# Altium project PCB_Project1.PrjPCB (part 1 of 2)
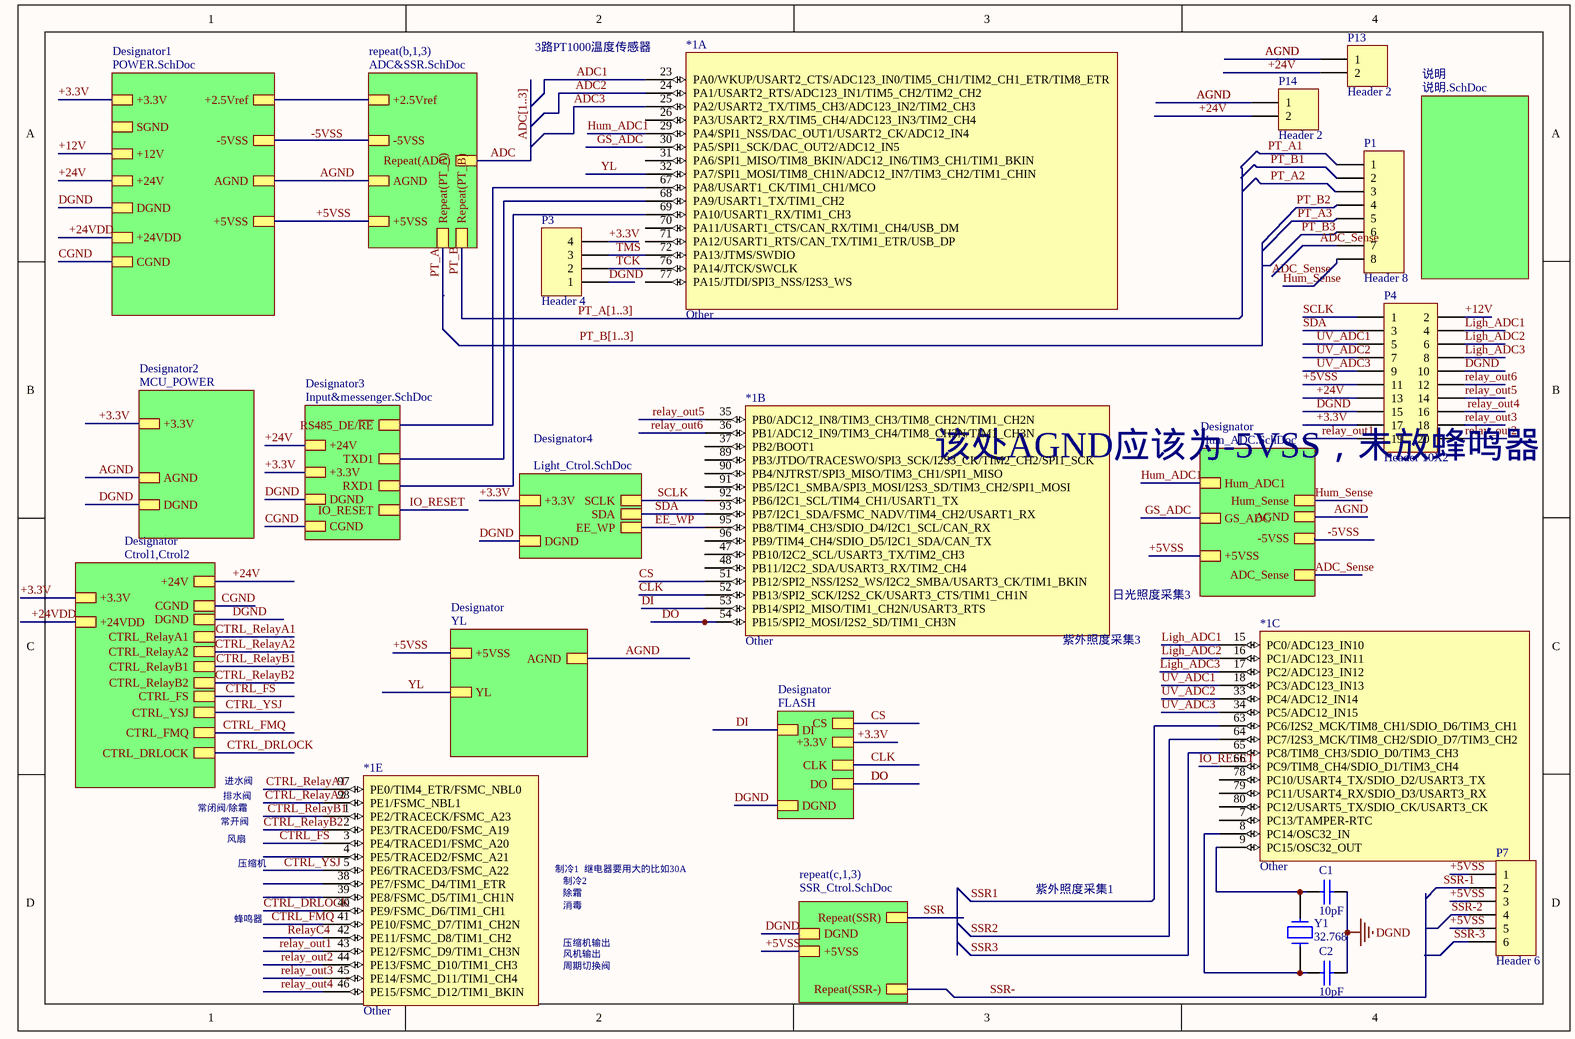
[diagram p0: main.SchDoc]
16 sheets, 275 parts. Net scope: hierarchical (ports join the sheet entries above them; power ports are global).
Board file: 新主控制.PcbDoc
Sheets:
  main.SchDoc
    Designator1 = POWER.SchDoc
    b1 = ADC&SSR.SchDoc
    b2 = ADC&SSR.SchDoc
    b3 = ADC&SSR.SchDoc
    Designator3 = Input&messenger.SchDoc
      d1 = In_put .SchDoc
      d2 = In_put .SchDoc
      d3 = In_put .SchDoc
      d4 = In_put .SchDoc
      d5 = In_put .SchDoc
      Designator5 = messenger.SchDoc
    Designator4 = Light_Ctrol.SchDoc
    Designator2 = MCU_POWER.SchDoc
    c1 = SSR_Ctrol.SchDoc
    c2 = SSR_Ctrol.SchDoc
    c3 = SSR_Ctrol.SchDoc
    说明 = 说明.SchDoc
    Designator = Hum_ADC.SchDoc
    Designator = FLASH.SchDoc
    Designator = Ctrol1,Ctrol2.SchDoc
      a1 = Ctrol1.SchDoc
      a2 = Ctrol1.SchDoc
      Designator = Ctrol2.SchDoc
    Designator = YL.SchDoc

## Sheet main.SchDoc
size A4

### Parts
*1  Other  [STM-LQFP100_N]  (parts A,B,C,E of 6)
C1  10pF  [0805C]
C2  10pF  [0805C]
P1  Header 8  [CONN-TH-KF7.62-8p]
P3  Header 4  [HDR1X4]
P4  Header 10X2  [HDR-TH_20P-P2.54_DC3-2.54-20PAS]
P7  Header 6  [CONN-TH_6P-P7.62_WJ25C-B-7.62-6P]
P13  Header 2  [2P]
P14  Header 2  [2PPPPP]
Y1  32.768  [XTAL6]

### Sub-sheets
Designator = Hum_ADC.SchDoc: Hum_ADC1, +5VSS, -5VSS, Hum_Sense, ADC_Sense, AGND, GS_ADC
Designator = FLASH: DGND, +3.3V, CLK, CS, DO, DI
Designator = Ctrol1,Ctrol2: +3.3V, +24V, DGND, CGND, CTRL_RelayA1, CTRL_RelayA2, CTRL_RelayB1, CTRL_RelayB2, CTRL_FS, CTRL_YSJ, CTRL_FMQ, CTRL_DRLOCK, +24VDD
Designator = YL: +5VSS, AGND, YL
Designator1 = POWER.SchDoc: +3.3V, +5VSS, +12V, +24V, AGND, DGND, -5VSS, SGND, +2.5Vref, CGND, +24VDD
Designator2 = MCU_POWER: +3.3V, AGND, DGND
Designator3 = Input&messenger.SchDoc: +24V, +3.3V, DGND, CGND, RS485_DE/~{RE}, TXD1, RXD1, IO_RESET
Designator4 = Light_Ctrol.SchDoc: SCLK, SDA, +3.3V, DGND, EE_WP
repeat(b,1,3) = ADC&SSR.SchDoc: -5VSS, AGND, +5VSS, +2.5Vref, Repeat(ADC), Repeat(PT_A), Repeat(PT_B)
repeat(c,1,3) = SSR_Ctrol.SchDoc: Repeat(SSR), DGND, +5VSS, Repeat(SSR-)
说明 = 说明.SchDoc: no entries

### Nets
+2.5Vref: sheet Designator1/+2.5Vref, sheet repeat(b,1,3)/+2.5Vref
+3.3V: P3.4 P4.17 ; sheet Designator1/+3.3V, sheet Designator3/+3.3V, sheet Designator4/+3.3V, sheet Designator2/+3.3V, sheet Designator/+3.3V, sheet Designator/+3.3V
+5VSS: P4.11 P7.1 P7.3 P7.5 ; sheet Designator1/+5VSS, sheet repeat(b,1,3)/+5VSS, sheet repeat(c,1,3)/+5VSS, sheet Designator/+5VSS, sheet Designator/+5VSS
+12V: P4.2 ; sheet Designator1/+12V
+24V: P4.13 P13.2 P14.2 ; sheet Designator1/+24V, sheet Designator3/+24V, sheet Designator/+24V
+24VDD: sheet Designator1/+24VDD, sheet Designator/+24VDD
-5VSS: sheet Designator1/-5VSS, sheet repeat(b,1,3)/-5VSS, sheet Designator/-5VSS
AGND: P13.1 P14.1 ; sheet Designator1/AGND, sheet repeat(b,1,3)/AGND, sheet Designator2/AGND, sheet Designator/AGND, sheet Designator/AGND
CGND: sheet Designator1/CGND, sheet Designator3/CGND, sheet Designator/CGND
DGND: C1.1 C2.1 P3.1 P4.10 P4.15 ; sheet Designator1/DGND, sheet Designator3/DGND, sheet Designator4/DGND, sheet Designator2/DGND, sheet repeat(c,1,3)/DGND, sheet Designator/DGND, sheet Designator/DGND
ADC: sheet repeat(b,1,3)/Repeat(ADC)
ADC1: *1.23(PA0/WKUP/USART2_CTS/ADC123_IN0/TIM5_CH1/TIM2_CH1_ETR/TIM8_ETR)  [project net ADC]
ADC2: *1.24(PA1/USART2_RTS/ADC123_IN1/TIM5_CH2/TIM2_CH2)  [project net ADC]
ADC3: *1.25(PA2/USART2_TX/TIM5_CH3/ADC123_IN2/TIM2_CH3)  [project net ADC]
ADC_Sense: P1.7 ; sheet Designator/ADC_Sense
CLK: *1.52(PB13/SPI2_SCK/I2S2_CK/USART3_CTS/TIM1_CH1N) ; sheet Designator/CLK
CS: *1.51(PB12/SPI2_NSS/I2S2_WS/I2C2_SMBA/USART3_CK/TIM1_BKIN) ; sheet Designator/CS
CTRL_DRLOCK: *1.40(PE9/FSMC_D6/TIM1_CH1) ; sheet Designator/CTRL_DRLOCK
CTRL_FMQ: *1.41(PE10/FSMC_D7/TIM1_CH2N) ; sheet Designator/CTRL_FMQ
CTRL_FS: *1.3(PE4/TRACED1/FSMC_A20) ; sheet Designator/CTRL_FS
CTRL_RelayA1: *1.97(PE0/TIM4_ETR/FSMC_NBL0) ; sheet Designator/CTRL_RelayA1
CTRL_RelayA2: *1.98(PE1/FSMC_NBL1) ; sheet Designator/CTRL_RelayA2
CTRL_RelayB1: *1.1(PE2/TRACECK/FSMC_A23) ; sheet Designator/CTRL_RelayB1
CTRL_RelayB2: *1.2(PE3/TRACED0/FSMC_A19) ; sheet Designator/CTRL_RelayB2
CTRL_YSJ: *1.5(PE6/TRACED3/FSMC_A22) ; sheet Designator/CTRL_YSJ
DI: *1.53(PB14/SPI2_MISO/TIM1_CH2N/USART3_RTS) ; sheet Designator/DI
DO: *1.54(PB15/SPI2_MOSI/I2S2_SD/TIM1_CH3N) ; sheet Designator/DO
EE_WP: *1.95(PB8/TIM4_CH3/SDIO_D4/I2C1_SCL/CAN_RX) ; sheet Designator4/EE_WP
GS_ADC: *1.30(PA5/SPI1_SCK/DAC_OUT2/ADC12_IN5) ; sheet Designator/GS_ADC
Hum_ADC1: *1.29(PA4/SPI1_NSS/DAC_OUT1/USART2_CK/ADC12_IN4) ; sheet Designator/Hum_ADC1
Hum_Sense: P1.8 ; sheet Designator/Hum_Sense
IO_RESET: *1.66(PC9/TIM8_CH4/SDIO_D1/TIM3_CH4) ; sheet Designator3/IO_RESET
Ligh_ADC1: *1.15(PC0/ADC123_IN10) P4.4
Ligh_ADC2: *1.16(PC1/ADC123_IN11) P4.6
Ligh_ADC3: *1.17(PC2/ADC123_IN12) P4.8
PT_A: sheet repeat(b,1,3)/Repeat(PT_A)
PT_A1: P1.1
PT_A2: P1.3
PT_A3: P1.5
PT_B: sheet repeat(b,1,3)/Repeat(PT_B)
PT_B1: P1.2
PT_B2: P1.4
PT_B3: P1.6
relay_out1: *1.43(PE12/FSMC_D9/TIM1_CH3N) P4.19
relay_out2: *1.44(PE13/FSMC_D10/TIM1_CH3) P4.20
relay_out3: *1.45(PE14/FSMC_D11/TIM1_CH4) P4.18
relay_out4: *1.46(PE15/FSMC_D12/TIM1_BKIN) P4.16
relay_out5: *1.35(PB0/ADC12_IN8/TIM3_CH3/TIM8_CH2N/TIM1_CH2N) P4.14
relay_out6: *1.36(PB1/ADC12_IN9/TIM3_CH4/TIM8_CH3N/TIM1_CH3N) P4.12
RelayC4: *1.42(PE11/FSMC_D8/TIM1_CH2)
RS485_DE/~{RE}: *1.67(PA8/USART1_CK/TIM1_CH1/MCO) ; sheet Designator3/RS485_DE/~{RE}
RXD1: *1.69(PA10/USART1_RX/TIM1_CH3) ; sheet Designator3/RXD1
SCLK: *1.92(PB6/I2C1_SCL/TIM4_CH1/USART1_TX) P4.1 ; sheet Designator4/SCLK
SDA: *1.93(PB7/I2C1_SDA/FSMC_NADV/TIM4_CH2/USART1_RX) P4.3 ; sheet Designator4/SDA
SSR: sheet repeat(c,1,3)/Repeat(SSR)
SSR1: *1.63(PC6/I2S2_MCK/TIM8_CH1/SDIO_D6/TIM3_CH1)
SSR2: *1.64(PC7/I2S3_MCK/TIM8_CH2/SDIO_D7/TIM3_CH2)
SSR3: *1.65(PC8/TIM8_CH3/SDIO_D0/TIM3_CH3)
SSR-: sheet repeat(c,1,3)/Repeat(SSR-)
SSR-1: P7.2
SSR-2: P7.4
SSR-3: P7.6
TCK: *1.76(PA14/JTCK/SWCLK) P3.2
TMS: *1.72(PA13/JTMS/SWDIO) P3.3
TXD1: *1.68(PA9/USART1_TX/TIM1_CH2) ; sheet Designator3/TXD1
UV_ADC1: *1.18(PC3/ADC123_IN13) P4.5
UV_ADC2: *1.33(PC4/ADC12_IN14) P4.7
UV_ADC3: *1.34(PC5/ADC12_IN15) P4.9
YL: *1.32(PA7/SPI1_MOSI/TIM8_CH1N/ADC12_IN7/TIM3_CH2/TIM1_CHIN) ; sheet Designator/YL
Net*1_8: *1.8(PC14/OSC32_IN) C2.2 Y1.1
Net*1_9: *1.9(PC15/OSC32_OUT) C1.2 Y1.2

Not connected (* = marked no-connect by the designer): *1 4(PE5/TRACED2/FSMC_A21) 7(PC13/TAMPER-RTC) 26(PA3/USART2_RX/TIM5_CH4/ADC123_IN3/TIM2_CH4) 31(PA6/SPI1_MISO/TIM8_BKIN/ADC12_IN6/TIM3_CH1/TIM1_BKIN) 37(PB2/BOOT1) 38(PE7/FSMC_D4/TIM1_ETR) 39(PE8/FSMC_D5/TIM1_CH1N) 47(PB10/I2C2_SCL/USART3_TX/TIM2_CH3) 48(PB11/I2C2_SDA/USART3_RX/TIM2_CH4) 70(PA11/USART1_CTS/CAN_RX/TIM1_CH4/USB_DM) 71(PA12/USART1_RTS/CAN_TX/TIM1_ETR/USB_DP) 77(PA15/JTDI/SPI3_NSS/I2S3_WS) 78(PC10/USART4_TX/SDIO_D2/USART3_TX) 79(PC11/USART4_RX/SDIO_D3/USART3_RX) 80(PC12/USART5_TX/SDIO_CK/USART3_CK) 89(PB3/JTDO/TRACESWO/SPI3_SCK/I2S3_CK/TIM2_CH2/SPI1_SCK) 90(PB4/NJTRST/SPI3_MISO/TIM3_CH1/SPI1_MISO) 91(PB5/I2C1_SMBA/SPI3_MOSI/I2S3_SD/TIM3_CH2/SPI1_MOSI) 96(PB9/TIM4_CH4/SDIO_D5/I2C1_SDA/CAN_TX)

### Buses and harness runs
bus ADC[1..3]
bus PT_A[1..3]
bus PT_B[1..3]

### Notes on the sheet
- 3路PT1000温度传感器
- 该处AGND应该为-5VSS，未放蜂鸣器
- 紫外照度采集3
- 日光照度采集3
- 进水阀
- 常闭阀/除霜
- 常开阀
- 排水阀
- 风扇
- 蜂鸣器
- 压缩机
- 制冷1  继电器要用大的比如30A
- 除霜
- 制冷2
- 消毒
- 紫外照度采集1
- 风机输出
- 压缩机输出
- 周期切换阀
- Labels drawn without touching a wire or pin: -5VSS, PT_B[1..3]

### Library data of the parts
*1 = stm32f103vct6
C1 C2 = CAP_3: 品牌： SAMSUNG(三星)  型号： CL21C100JCANNNC 容值：10pF 精度：±5% 额定电压：100V 材质(温度系数)：C0G C0G
P1 = Header 8: DG141V-2.54-8; LatestRevisionDate: 17-Jul-2002; LatestRevisionNote: Re-released for DXP Platform.; Publisher: Altium Limited
P3 = Header 4: 品牌： XFCN(兴飞) 型号： PZ254V-11-04P  排数：单排 总PIN位数：4P 间距：2.54mm 插针结构：1x4P 安装类型：直插 圆针/方针：方针 额定电流：3A 额定电压：250V 配合针长度：6mm 塑高：2.5mm 端接针长度：3mm 工作温度范围：-40℃~+105℃ 颜色：黑色; LatestRevisionDate: 17-Jul-2002; LatestRevisionNote: Re-released for DXP Platform.; Publisher: Altium Limited
P4 = Header 10X2: 品牌： ZHOURI(洲日)   型号： DC3-2.54-20PAS  ：连接器类型：简牛座 间距：2.54mm 结构：2x10P 排数：2 每排PIN数：10 行距：2.54mm 封装形式：直插 额定电流：1.5A 工作温度范围：-40℃~+105℃ 简易牛角 2.54-2x10 ROHS 直插; LatestRevisionDate: 17-Jul-2002; LatestRevisionNote: Re-released for DXP Platform.; Publisher: Altium Limited
P7 = Header 6: 品牌： KEFA(科发)  KF7.62-6p隔板类型：两面 间距：7.62mm 结构：1x2P 每排PIN数：2 排数：1 安装方式：直针 引脚位置：边脚 额定电流：24A 额定电压：450V 线规 - AWG：12~22 线规 - mm2：2.5 工作温度范围：-40℃~+105℃ 颜色：黑色 黑色; LatestRevisionDate: 17-Jul-2002; LatestRevisionNote: Re-released for DXP Platform.; Publisher: Altium Limited
P13 P14 = Header 2: DG141V-2.54-2P; LatestRevisionDate: 17-Jul-2002; LatestRevisionNote: Re-released for DXP Platform.; Publisher: Altium Limited
  P14: ComponentLink1Description: New link; ComponentLink1URL: *
Y1 = XTAL-2: 品牌： YXC(扬兴晶振)  型号： X308032768KGB2SC 频率：32.768kHz 频率公差：±10ppm 负载电容：12.5pF YT-38 温飘系数: -0.04x 10^(-6)/℃2

## Sheet POWER.SchDoc
size A4
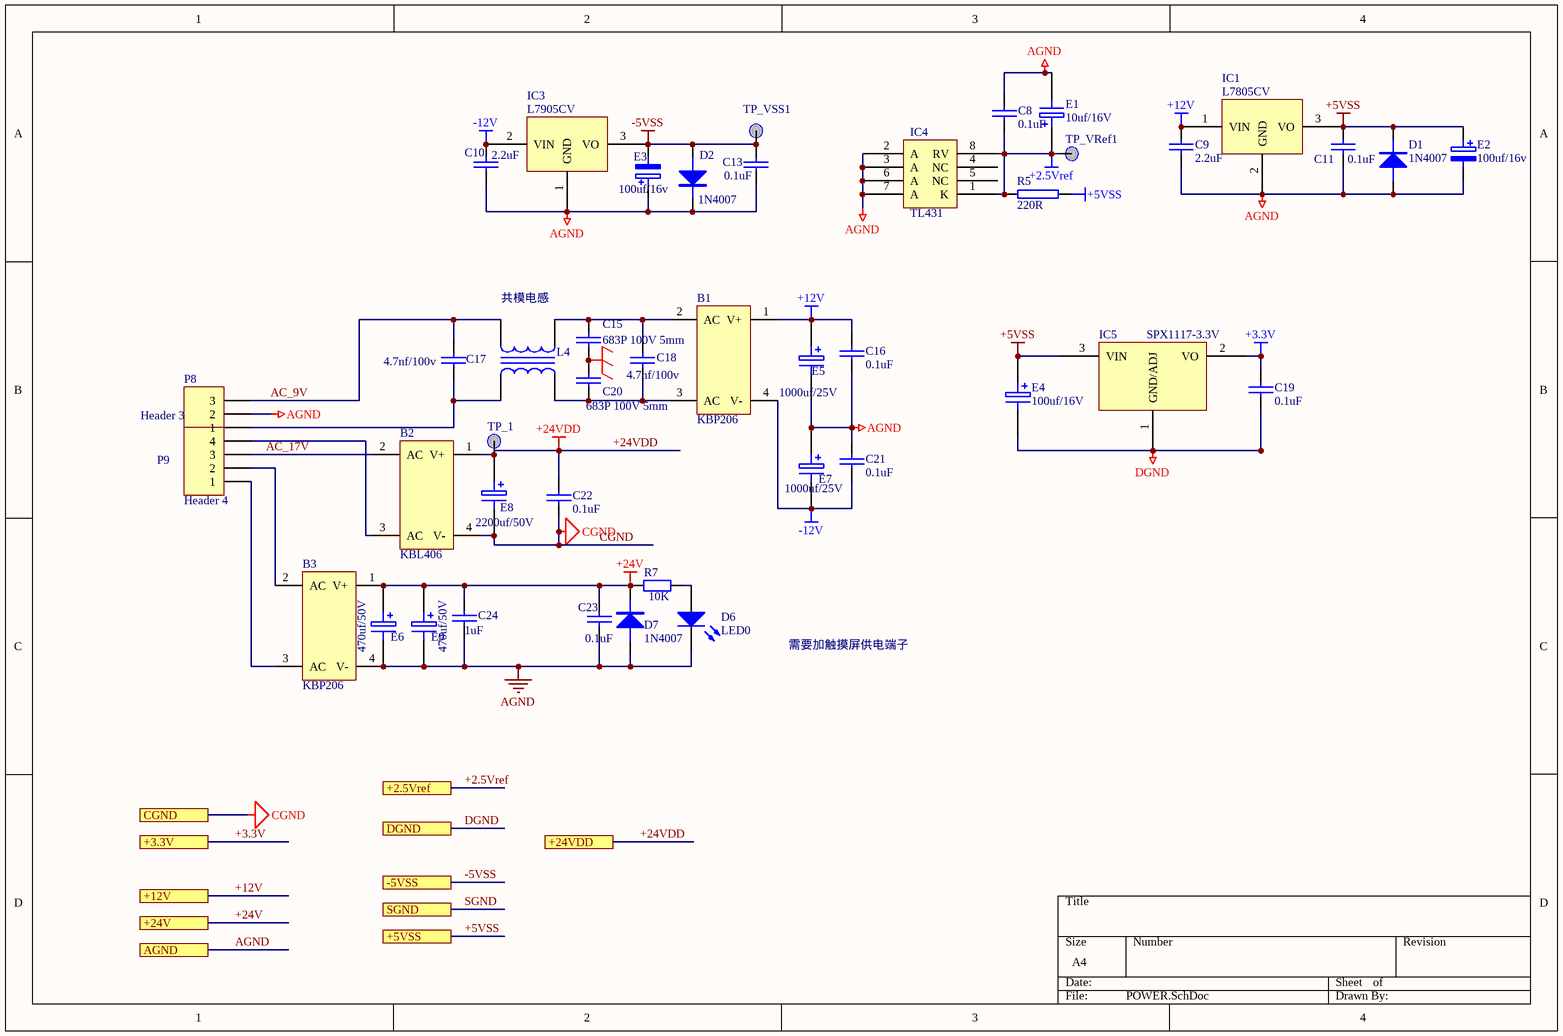
[diagram p1: POWER.SchDoc]

### Parts
B1  KBP206  [KBP206]
B2  KBL406  [KPL406]
B3  KBP206  [KBP206]
C8  0.1uF  [0805C]
C9  2.2uF  [0805C]
C10  2.2uF  [0805C]
C11  0.1uF  [0805C]
C13  0.1uF  [0805C]
C15  683P 100V 5mm  [CP1]
C16  0.1uF  [0805C]
C17  4.7nf/100v  [CP1]
C18  4.7nf/100v  [CP1]
C19  0.1uF  [0805C]
C20  683P 100V 5mm  [CP1]
C21  0.1uF  [0805C]
C22  0.1uF  [0805C]
C23  0.1uF  [0805C]
C24  1uF  [0805C]
D1  1N4007  [SK24]
D2  1N4007  [SK24]
D6  LED0  [0805LED]
D7  1N4007  [SK24]
E1  10uf/16V  [3528]
E2  100uf/16v  [3528]
E3  100uf/16v  [3528]
E4  100uf/16V  [3528]
E5  1000uf/25V  [EC5.08-10.5]
E6  470uf/50V  [EC5.08-10.5]
E7  1000uf/25V  [EC5.08-10.5]
E8  2200uf/50V  [EC5.08-13.5]
E9  470uf/50V  [EC5.08-10.5]
IC1  L7805CV  [DPAK3]
IC3  L7905CV  [DPAK3]
IC4  TL431  [SO8]
IC5  SPX1117-3.3V  [SOT223]
L4  共模电感  [TRANS]
P8  Header 3  [CONN-TH-KF7.62-3P]
P9  Header 4  [CONN-TH_KF7.62-4P]
R5  220R  [0805R]
R7  10K  [0805R]
TP_1  (no value)  [TPP]
TP_VRef1  (no value)  [TPP]
TP_VSS1  (no value)  [TPP]

### Ports
+2.5Vref, +3.3V, +5VSS, +12V, +24V, +24VDD, -5VSS, AGND, CGND, DGND, SGND

### Nets
+2.5Vref: C8.2 E1.1 IC4.1(K) IC4.8(RV) R5.1 TP_VRef1.1 ; port +2.5Vref
+3.3V: C19.1 IC5.2(VO) ; port +3.3V
+5VSS: C11.1 D1.2(K) E2.1 E4.1 IC1.3(VO) IC5.3(VIN) R5.2 ; port +5VSS
+12V: B1.1(V+) C9.1 C16.1 E5.1 IC1.1(VIN) ; port +12V
+24V: B3.1(V+) C23.1 C24.1 D7.2(K) E6.1 E9.1 R7.2 ; port +24V
+24VDD: B2.1(V+) C22.1 E8.1 TP_1.1 ; port +24VDD
-5VSS: C13.1 D2.1(A) E3.2 IC3.3(VO) TP_VSS1.1 ; port -5VSS
-12V: B1.4(V-) C10.1 C21.2 E7.2 IC3.2(VIN)
AGND: B3.4(V-) C8.1 C9.2 C10.2 C11.2 C13.2 C16.2 C21.1 C23.2 C24.2 D1.1(A) D2.2(K) D6.2(K) D7.1(A) E1.2 E2.2 E3.1 E5.2 E6.2 E7.1 E9.2 IC1.2(GND) IC3.1(GND) IC4.2(A) IC4.3(A) IC4.6(A) IC4.7(A) P8.2 ; port AGND
CGND: B2.4(V-) C22.2 E8.2 ; port CGND
DGND: C19.2 E4.2 IC5.1(GND/ADJ) ; port DGND
EGND: C15.2 C20.1
AC_9V: C17.1 L4.2 P8.3
AC_17V: B2.2(AC) P9.3
SGND: port SGND
NetB1_2: B1.2(AC) C15.1 C18.1 L4.4
NetB1_3: B1.3(AC) C18.2 C20.2 L4.3
NetB2_3: B2.3(AC) P9.4
NetB3_2: B3.2(AC) P9.2
NetB3_3: B3.3(AC) P9.1
NetC17_2: C17.2 L4.1 P8.1
NetD6_1: D6.1(A) R7.1

Not connected (* = marked no-connect by the designer): IC4 4(NC) 5(NC)

### Notes on the sheet
- 需要加触摸屏供电端子

### Library data of the parts
B1 B3 = BRIDGE: 品牌： MDD  型号： KBP206  直流反向耐压(Vr)：600V 平均整流电流(Io)：2A 正向压降(Vf)：1.1V@2A 正向浪涌电流(Ifsm)：60A
B2 = BRIDGE: 品牌： MDD  型号： KBL406  直流反向耐压(Vr)：600V 平均整流电流(Io)：4A 正向压降(Vf)：1V@4A 正向浪涌电流(Ifsm)：125A
C8 = CAP
C9 C10 = Cap: 品牌： SAMSUNG(三星) 型号： CL21B225KAFNNNE 容值：2.2uF 精度：±10% 额定电压：25V 材质(温度系数)：X7R 材质:X7R; Value: 104P
C11 C22 = Cap: 品牌： SAMSUNG(三星) 型号： CL21B104KBCNNNC ：容值：100nF 精度：±10% 额定电压：50V 材质(温度系数)：X7R 材质:X7R; Value: 104P
C13 C16 = Cap: 品牌： SAMSUNG(三星)    型号： CL10B104KB8NNNC  容值：100nF 精度：±10% 额定电压：50V 材质(温度系数)：X7R 材质:X7R; Value: 104P
C15 C20 = Cap: 品牌： muRata(村田) 型号： RCER72A683K1K1H03B  容值：68nF 精度：±10% 额定电压：100V 温度系数：X7R; Value: 683P 100V 5mm
C17 = Cap: 品牌： muRata(村田) 品牌： muRata(村田)  容值：4.7nF 精度：±10% 额定电压：100V 温度系数：X7R; Value: 472P 100V 5mm
C18 = Cap: 品牌： muRata(村田) 品牌： muRata(村田)  容值：4.7nF 精度：±10% 额定电压：100V 温度系数：X7R; Value: 472P
C19 = CAP: Capacitor
C21 = Cap: 品牌： SAMSUNG(三星)    型号： CL10B104KB8NNNC  容值：100nF 精度：±10% 额定电压：50V 材质(温度系数)：X7R 材质:X7R
C23 = Cap: 品牌： SAMSUNG(三星) 型号： CL21B104KBCNNNC ：容值：100nF 精度：±10% 额定电压：50V 材质(温度系数)：X7R 材质:X7R; Value: 0.1uF
C24 = Cap: 品牌： SAMSUNG(三星) 型号： CL21B334KBFNNNE 容值：330nF 精度：±10% 额定电压：50V 材质(温度系数)：X7R 材质:X7R; Value: 0.33uF
D1 D2 D7 = DIODE: 品牌： TWGMC(台湾迪嘉) 型号： 1N4001 极管配置：独立式 直流反向耐压(Vr)：50V 平均整流电流(Io)：1A 正向压降(Vf)：1.1V@1A 二极管配置：独立式 直流反向耐压(Vr)：50V 平均整流电流(Io)：1A 正向压降(Vf)：1.1V@1A
D6 = LED0: 品牌： 国星光电 型号： NCD0805B2 发光颜色：蓝灯 贴片LED；0805蓝色；2012蓝色；透镜颜色：无色透明；发光角度：130°；功率：72mW；工作温度：-30℃~+85℃；; Published: 8-Jun-2000; LatestRevisionDate: 08-Jul-2005; LatestRevisionNote: Mech Layer 1 removed.; PackageReference: LED-0; Publisher: Altium Limited; PackageDescription: LED; 2 Leads
E1 = ELECTRO1: 品牌： Kyocera AVX 型号： TAJB106K016RNJ ：容值：10uF 精度：±10% 额定电压：16V 等效串联电阻：2.8Ω@100kHz
E2 E3 = ELECTRO2: 品牌： Kyocera AVX 型号： TAJB107M010RNJ  容值：100uF 精度：±20% 额定电压：10V 等效串联电阻：1.4Ω@100kHz; Value: 100uf/16V
E4 = ELECTRO1: Electrolytic Capacitor
E5 E7 = ELECTRO1: 品牌： CX(承兴) 型号： KM108M025G17RR0VH2FP0 容值：1000uF 精度：±20% 额定电压：25V; Value: 1000uf/25V
E6 E9 = ELECTRO1: 品牌： CX(承兴) 型号： KM108M025G17RR0VH2FP0 容值：1000uF 精度：±20% 额定电压：25V; Value: 1000uf/25V
E8 = ELECTRO1: 品牌： CX(承兴) 型号： KM228M050K30RR0VH2FP0 容值：2200uF 精度：±20% 额定电压：50V; Value: 2200uf/50V
IC1 = MC78XX: 品牌： UMW(友台半导体)  型号： L7805CV  输出类型：固定 输出极性：正 最大输入电压：35V 输出电压：5V 输出电流：1.2A
IC3 = MC79XX: 品牌： ST(意法半导体) 封装： TO-220 输出类型：固定 输出极性：负 最大输入电压：35V 输出电压：5V 输出电流：1.5A 电源纹波抑制比(PSRR)：60dB@(120Hz) 薄片 5.0V
IC4 = TL431-SO8: 品牌： JSMSEMI(杰盛微) 型号： TL431输出类型：可调 输入电压：37V 输出电压：2.5V~36V
IC5 = SPX1117
L4 = TRANS1: UF16 22mH 1.5A 12.5*10
P8 = Header 3: 品牌： KEFA(科发)  KF7.62-3p隔板类型：两面 间距：7.62mm 结构：1x2P 每排PIN数：2 排数：1 安装方式：直针 引脚位置：边脚 额定电流：24A 额定电压：450V 线规 - AWG：12~22 线规 - mm2：2.5 工作温度范围：-40℃~+105℃ 颜色：黑色 黑色; LatestRevisionDate: 17-Jul-2002; LatestRevisionNote: Re-released for DXP Platform.; Publisher: Altium Limited
P9 = Header 4: 品牌： KEFA(科发)  KF7.62-4p隔板类型：两面 间距：7.62mm 结构：1x2P 每排PIN数：2 排数：1 安装方式：直针 引脚位置：边脚 额定电流：24A 额定电压：450V 线规 - AWG：12~22 线规 - mm2：2.5 工作温度范围：-40℃~+105℃ 颜色：黑色 黑色; LatestRevisionDate: 17-Jul-2002; LatestRevisionNote: Re-released for DXP Platform.; Publisher: Altium Limited
R5 = RES2: 品牌： UNI-ROYAL(厚声) 型号： 0805W8J0221T5E 电阻类型：厚膜电阻 阻值：220Ω 精度：±5% 功率：125mW 温度系数：±100ppm/℃
R7 = Res2: 品牌： UNI-ROYAL(厚声) 型号： 0805W8F1002T5E 电阻类型：厚膜电阻 阻值：10kΩ 精度：±1% 功率：125mW 温度系数：±100ppm/℃; Published: 8-Jun-2000; LatestRevisionDate: 17-Jul-2002; LatestRevisionNote: Re-released for DXP Platform.; PackageReference: AXIAL-0.4; Publisher: Altium Limited; PackageDescription: Axial Device, Thru-Hole; 2 Leads; 0.4 in Pin Spacing; Value: 10K
TP_1 TP_VRef1 TP_VSS1 = TP

## Sheet ADC&SSR.SchDoc
size A4
Used 3 times, as channels b1, b2, b3. Parts and nets are listed once, with the designators drawn on the sheet.
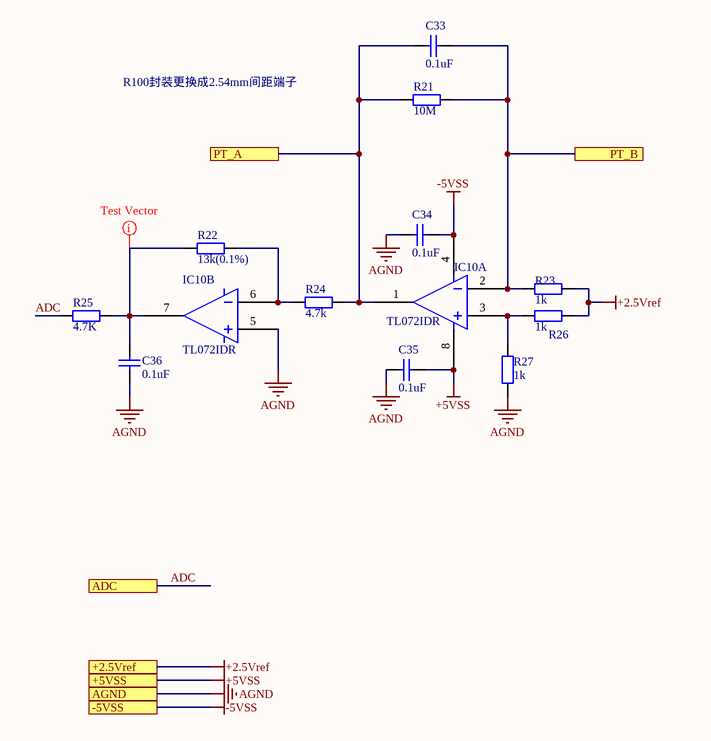
[diagram p2: ADC&SSR.SchDoc]

### Parts
C33  0.1uF  [0805C]
C34  0.1uF  [0805C]
C35  0.1uF  [0805C]
C36  0.1uF  [0805C]
IC10  TL072IDR  [SOP8]  (parts A,B of 2)
R21  10M  [0805R]
R22  13k(0.1%)  [0805R]
R23  1k  [0805R]
R24  4.7k  [0805R]
R25  4.7K  [0805R]
R26  1k  [0805R]
R27  1k  [0805R]

### Ports
+2.5Vref, +5VSS, -5VSS, ADC, AGND, PT_A, PT_B

### Nets
+2.5Vref: R23.1 R26.1 ; port +2.5Vref
+5VSS: C35.2 IC10.8 ; port +5VSS
-5VSS: C34.2 IC10.4 ; port -5VSS
AGND: C34.1 C35.1 C36.1 IC10.5 R27.2 ; port AGND
ADC: R25.2 ; port ADC
PT_A: C33.1 IC10.1 R21.1 R24.1 ; port PT_A
PT_B: C33.2 IC10.2 R21.2 R23.2 ; port PT_B
NetC36_2: C36.2 IC10.7 R22.2 R25.1
NetIC10_3: IC10.3 R26.2 R27.1
NetIC10_6: IC10.6 R22.1 R24.2

### Channels
b1: designators end in _b1; ports +2.5Vref=+2.5Vref +5VSS=+5VSS -5VSS=-5VSS ADC=ADC AGND=AGND PT_A=PT_A1 PT_B=PT_B1
b2: designators end in _b2; ports +2.5Vref=+2.5Vref +5VSS=+5VSS -5VSS=-5VSS ADC=ADC AGND=AGND PT_A=PT_A2 PT_B=PT_B2
b3: designators end in _b3; ports +2.5Vref=+2.5Vref +5VSS=+5VSS -5VSS=-5VSS ADC=ADC AGND=AGND PT_A=PT_A3 PT_B=PT_B3

### Layout directives
Column: TestVectorIndex: NetC36_b1_2

### Notes on the sheet
- R100封装更换成2.54mm间距端子

### Library data of the parts
C33 = Cap: 品牌： SAMSUNG(三星)   型号： CL21C101JBANNNC   容值：100pF 精度：±5% 额定电压：50V 材质(温度系数)：C0G 材质:C0G; Value: 0.1nF; Published: 8-Jun-2000; LatestRevisionDate: 17-Jul-2002; LatestRevisionNote: Re-released for DXP Platform.; PackageReference: RAD-0.3; Publisher: Altium Limited; PackageDescription: Radial Cap, Thru-Hole; 2 Leads; 0.3 in Pin Spacing
C34-C36 = Cap: as C23 on sheet POWER; Published: 8-Jun-2000; LatestRevisionDate: 17-Jul-2002; LatestRevisionNote: Re-released for DXP Platform.; PackageReference: RAD-0.3; Publisher: Altium Limited; PackageDescription: Radial Cap, Thru-Hole; 2 Leads; 0.3 in Pin Spacing; Value: 0.1uF
IC10 = TL072_1: 品牌： TI(德州仪器)   型号： TL072IDR  放大器组数：2 增益带宽积(GBP)：5.25MHz 压摆率(SR)：13V/us 输入失调电压(Vos)：3mV 输入偏置电流(Ib)：65pA TL072 双路低噪声 JFET 输入通用运算放大器
R21 = Res2: 品牌： Sunway(信维通信)   型号： SC0805J1005F4ANRH   阻值：10MΩ 精度：±5% 功率：125mW 温度系数：±100ppm/℃ 贴片厚膜电阻：体积0805_精度：±5% 阻值10M; Published: 8-Jun-2000; LatestRevisionDate: 17-Jul-2002; LatestRevisionNote: Re-released for DXP Platform.; PackageReference: AXIAL-0.4; Publisher: Altium Limited; PackageDescription: Axial Device, Thru-Hole; 2 Leads; 0.4 in Pin Spacing; Value: 10M
R22 = Res2: 品牌： UNI-ROYAL(厚声)  型号： 0805W8F1302T5E  电阻类型：厚膜电阻 阻值：13kΩ 精度：±1% 功率：125mW 温度系数：±100ppm/℃; Published: 8-Jun-2000; LatestRevisionDate: 17-Jul-2002; LatestRevisionNote: Re-released for DXP Platform.; PackageReference: AXIAL-0.4; Publisher: Altium Limited; PackageDescription: Axial Device, Thru-Hole; 2 Leads; 0.4 in Pin Spacing; Value: 13k(0.1%)
R23 R26 R27 = Res2: 品牌： UNI-ROYAL(厚声) 型号： 0805W8F1001T5E 电阻类型：厚膜电阻 阻值：1kΩ 精度：±1% 功率：125mW 温度系数：±100ppm/℃; Value: 1k(0.1%); Published: 8-Jun-2000; LatestRevisionDate: 17-Jul-2002; LatestRevisionNote: Re-released for DXP Platform.; PackageReference: AXIAL-0.4; Publisher: Altium Limited; PackageDescription: Axial Device, Thru-Hole; 2 Leads; 0.4 in Pin Spacing
R24 = Res2: 品牌： UNI-ROYAL(厚声) 型号： 0805W8F4701T5E 电阻类型：厚膜电阻 阻值：4.7kΩ 精度：±1% 功率：125mW 温度系数：±100ppm/℃; Value: 4.7k(0.1%); Published: 8-Jun-2000; LatestRevisionDate: 17-Jul-2002; LatestRevisionNote: Re-released for DXP Platform.; PackageReference: AXIAL-0.4; Publisher: Altium Limited; PackageDescription: Axial Device, Thru-Hole; 2 Leads; 0.4 in Pin Spacing
R25 = Res2: 品牌： UNI-ROYAL(厚声) 型号： 0805W8F4701T5E 电阻类型：厚膜电阻 阻值：4.7kΩ 精度：±1% 功率：125mW 温度系数：±100ppm/℃; Published: 8-Jun-2000; LatestRevisionDate: 17-Jul-2002; LatestRevisionNote: Re-released for DXP Platform.; PackageReference: AXIAL-0.4; Publisher: Altium Limited; PackageDescription: Axial Device, Thru-Hole; 2 Leads; 0.4 in Pin Spacing; Value: 4.7K

## Sheet Input&messenger.SchDoc
size A4
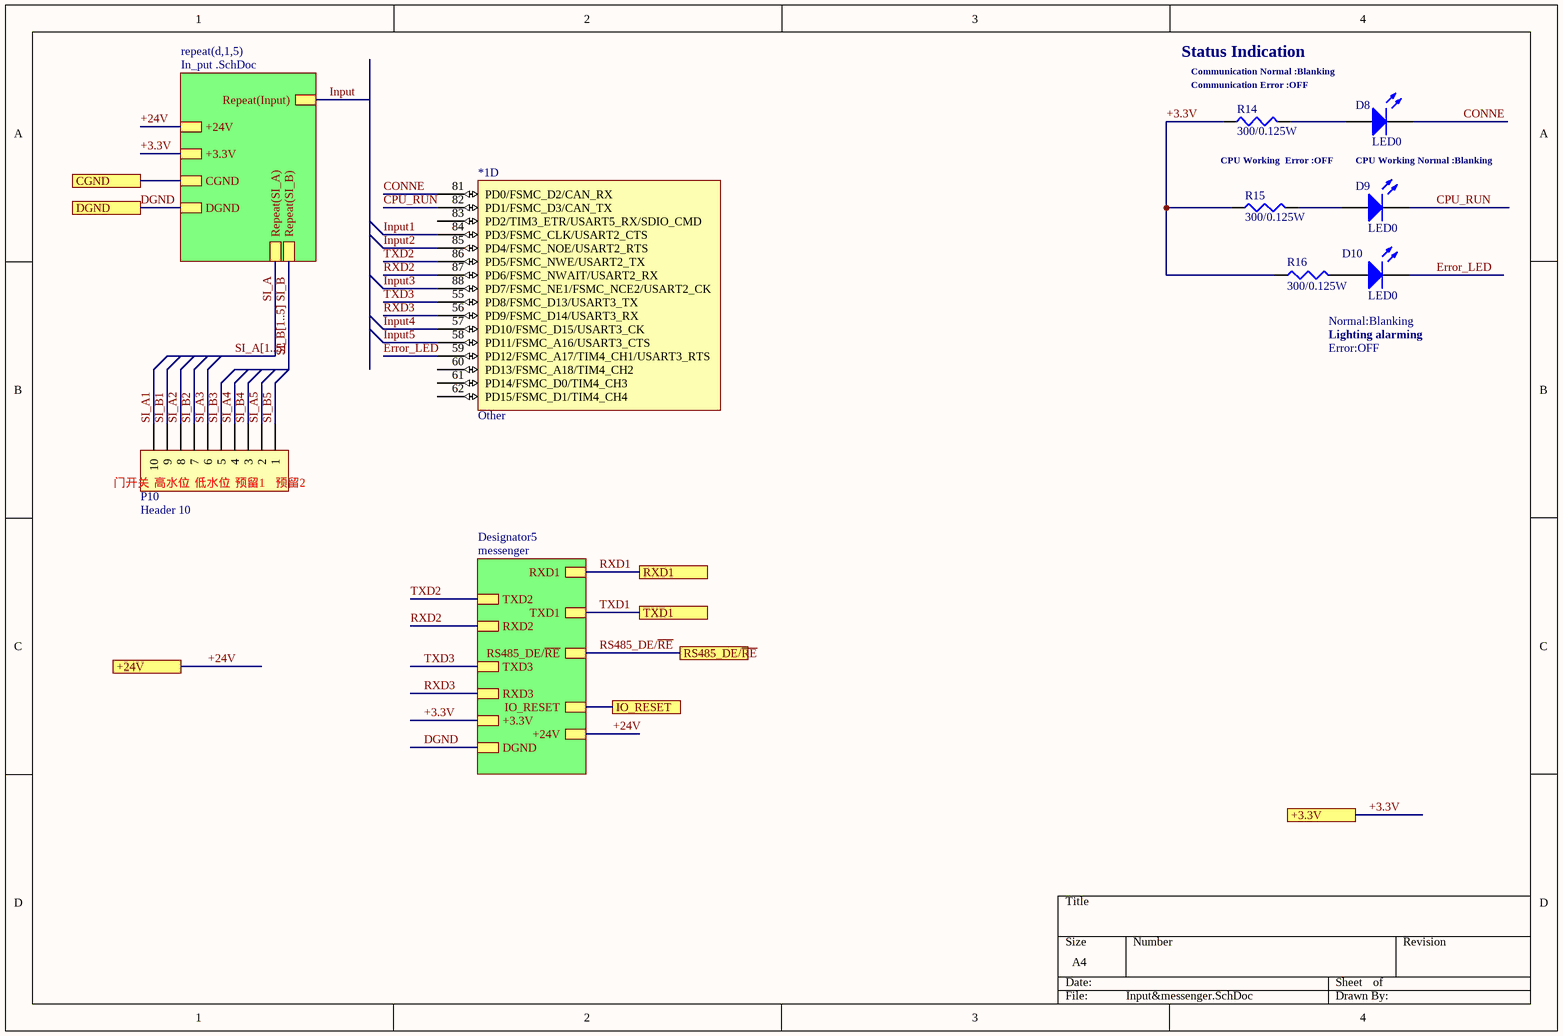
[diagram p3: Input&messenger.SchDoc]

### Parts
*1  Other  [STM-LQFP100_N]  (part D of 6)
D8  LED0  [0805LED]
D9  LED0  [0805LED]
D10  LED0  [0805LED]
P10  Header 10  [CONN-TH-KF7.62-10P]
R14  300/0.125W  [0805R]
R15  300/0.125W  [0805R]
R16  300/0.125W  [0805R]

### Sub-sheets
Designator5 = messenger: TXD2, RXD2, TXD3, RXD3, +3.3V, DGND, RXD1, TXD1, RS485_DE/~{RE}, +24V, IO_RESET
repeat(d,1,5) = In_put .SchDoc: Repeat(Input), +3.3V, CGND, DGND, +24V, Repeat(SI_A), Repeat(SI_B)

### Ports
+3.3V, +24V, CGND, DGND, IO_RESET, RS485_DE/~{RE}, RXD1, TXD1

### Nets
+3.3V: R14.1 R15.1 R16.1 ; port +3.3V, sheet repeat(d,1,5)/+3.3V, sheet Designator5/+3.3V
+24V: port +24V, sheet repeat(d,1,5)/+24V, sheet Designator5/+24V
CGND: port CGND, sheet repeat(d,1,5)/CGND
DGND: port DGND, sheet repeat(d,1,5)/DGND, sheet Designator5/DGND
CONNE: *1.81(PD0/FSMC_D2/CAN_RX) D8.2(K)
CPU_RUN: *1.82(PD1/FSMC_D3/CAN_TX) D9.2(K)
Error_LED: *1.59(PD12/FSMC_A17/TIM4_CH1/USART3_RTS) D10.2(K)
Input: sheet repeat(d,1,5)/Repeat(Input)
Input1: *1.84(PD3/FSMC_CLK/USART2_CTS)
Input2: *1.85(PD4/FSMC_NOE/USART2_RTS)
Input3: *1.88(PD7/FSMC_NE1/FSMC_NCE2/USART2_CK)
Input4: *1.57(PD10/FSMC_D15/USART3_CK)
Input5: *1.58(PD11/FSMC_A16/USART3_CTS)
IO_RESET: port IO_RESET, sheet Designator5/IO_RESET
RS485_DE/~{RE}: port RS485_DE/~{RE}, sheet Designator5/RS485_DE/~{RE}
RXD1: port RXD1, sheet Designator5/RXD1
RXD2: *1.87(PD6/FSMC_NWAIT/USART2_RX) ; sheet Designator5/RXD2
RXD3: *1.56(PD9/FSMC_D14/USART3_RX) ; sheet Designator5/RXD3
SI_A: sheet repeat(d,1,5)/Repeat(SI_A)
SI_A1: P10.10
SI_A2: P10.8
SI_A3: P10.6
SI_A4: P10.4
SI_A5: P10.2
SI_B: sheet repeat(d,1,5)/Repeat(SI_B)
SI_B1: P10.9
SI_B2: P10.7
SI_B3: P10.5
SI_B4: P10.3
SI_B5: P10.1
TXD1: port TXD1, sheet Designator5/TXD1
TXD2: *1.86(PD5/FSMC_NWE/USART2_TX) ; sheet Designator5/TXD2
TXD3: *1.55(PD8/FSMC_D13/USART3_TX) ; sheet Designator5/TXD3
NetD8_1: D8.1(A) R14.2
NetD9_1: D9.1(A) R15.2
NetD10_1: D10.1(A) R16.2

Not connected (* = marked no-connect by the designer): *1 60(PD13/FSMC_A18/TIM4_CH2) 61(PD14/FSMC_D0/TIM4_CH3) 62(PD15/FSMC_D1/TIM4_CH4) 83(PD2/TIM3_ETR/USART5_RX/SDIO_CMD)

### Buses and harness runs
bus SI_A[1..5]
bus SI_B[1..5]

### Notes on the sheet
- Status Indication
- Communication Normal :Blanking
- (near R14) Communication Error :OFF
- CPU Working  Error :OFF
- CPU Working Normal :Blanking
- Lighting alarming
- Normal:Blanking
- Error:OFF
- (near P10) 门开关
- (near P10) 高水位
- (near P10) 低水位
- (near P10) 预留1
- (near P10) 预留2

### Library data of the parts
*1 = stm32f103vct6
D8-D10 = LED0: 品牌： 国星光电  型号： NCD0805G1  发光颜色：翠绿 贴片LED；0805翠绿；2012翠绿；透镜颜色：无色透明；发光角度：130°；功率：72mW；工作温度：-30℃~+85℃； 尺寸2.0*1.25*1.1；IF=5ma：2.5~3.6v，525~537.5nm,180~400mcd 金线，光强高，功耗低，可靠性好，寿命长; Published: 8-Jun-2000; LatestRevisionDate: 08-Jul-2005; LatestRevisionNote: Mech Layer 1 removed.; PackageReference: LED-0; Publisher: Altium Limited; PackageDescription: LED; 2 Leads
P10 = Header 10: 品牌： KEFA(科发)  KF7.62-10p隔板类型：两面 间距：7.62mm 结构：1x2P 每排PIN数：2 排数：1 安装方式：直针 引脚位置：边脚 额定电流：24A 额定电压：450V 线规 - AWG：12~22 线规 - mm2：2.5 工作温度范围：-40℃~+105℃ 颜色：黑色 黑色; LatestRevisionDate: 17-Jul-2002; LatestRevisionNote: Re-released for DXP Platform.; Publisher: Altium Limited
R14-R16 = RES1: 品牌： UNI-ROYAL(厚声)    型号： 0805W8F3000T5E    电阻类型：厚膜电阻 阻值：300Ω 精度：±1% 功率：125mW 温度系数：±100ppm/℃

## Sheet In_put .SchDoc
size A4
Used 5 times, as channels Designator3/d1, Designator3/d2, Designator3/d3, Designator3/d4, Designator3/d5. Parts and nets are listed once, with the designators drawn on the sheet.
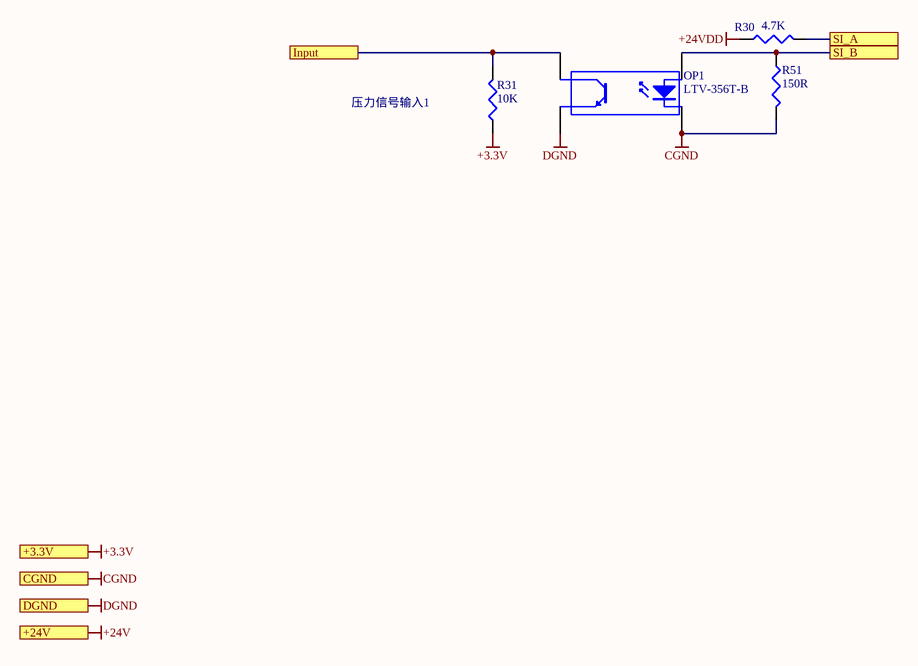
[diagram p4: In_put .SchDoc]

### Parts
OP1  LTV-356T-B  [TLV-356]
R30  4.7K  [0805R]
R31  10K  [0805R]
R51  150R  [0805R]

### Ports
+3.3V, +24V, CGND, DGND, Input, SI_A, SI_B

### Nets
+3.3V: R31.1 ; port +3.3V
+24V: port +24V
+24VDD: R30.1
CGND: OP1.2(K) R51.2 ; port CGND
DGND: OP1.3(E) ; port DGND
Input: OP1.4(C) R31.2 ; port Input
SI_A: R30.2 ; port SI_A
SI_B: OP1.1(A) R51.1 ; port SI_B

### Channels
Designator3/d1: designators end in _d1; ports +3.3V=+3.3V +24V=+24V CGND=CGND DGND=DGND Input=Input1 SI_A=SI_A1 SI_B=SI_B1
Designator3/d2: designators end in _d2; ports +3.3V=+3.3V +24V=+24V CGND=CGND DGND=DGND Input=Input2 SI_A=SI_A2 SI_B=SI_B2
Designator3/d3: designators end in _d3; ports +3.3V=+3.3V +24V=+24V CGND=CGND DGND=DGND Input=Input3 SI_A=SI_A3 SI_B=SI_B3
Designator3/d4: designators end in _d4; ports +3.3V=+3.3V +24V=+24V CGND=CGND DGND=DGND Input=Input4 SI_A=SI_A4 SI_B=SI_B4
Designator3/d5: designators end in _d5; ports +3.3V=+3.3V +24V=+24V CGND=CGND DGND=DGND Input=Input5 SI_A=SI_A5 SI_B=SI_B5

### Notes on the sheet
- 压力信号输入1

### Library data of the parts
OP1 = OPTOISO1: 品牌名称 / LITEON(光宝) / 商品型号 / LTV-356T-B / 商品编号 / C10804 / 商品封装 / SOP-4-2.54mm
R30 R51 = RES1: 电阻类型：厚膜电阻 阻值：4.7kΩ 精度：±1% 功率：125mW 温度系数：±100ppm/℃
R31 = RES1: 品牌： UNI-ROYAL(厚声) 型号： 0805W8F1002T5E 电阻类型：厚膜电阻 阻值：10kΩ 精度：±1% 功率：125mW 温度系数：±100ppm/℃

## Sheet messenger.SchDoc
size A4
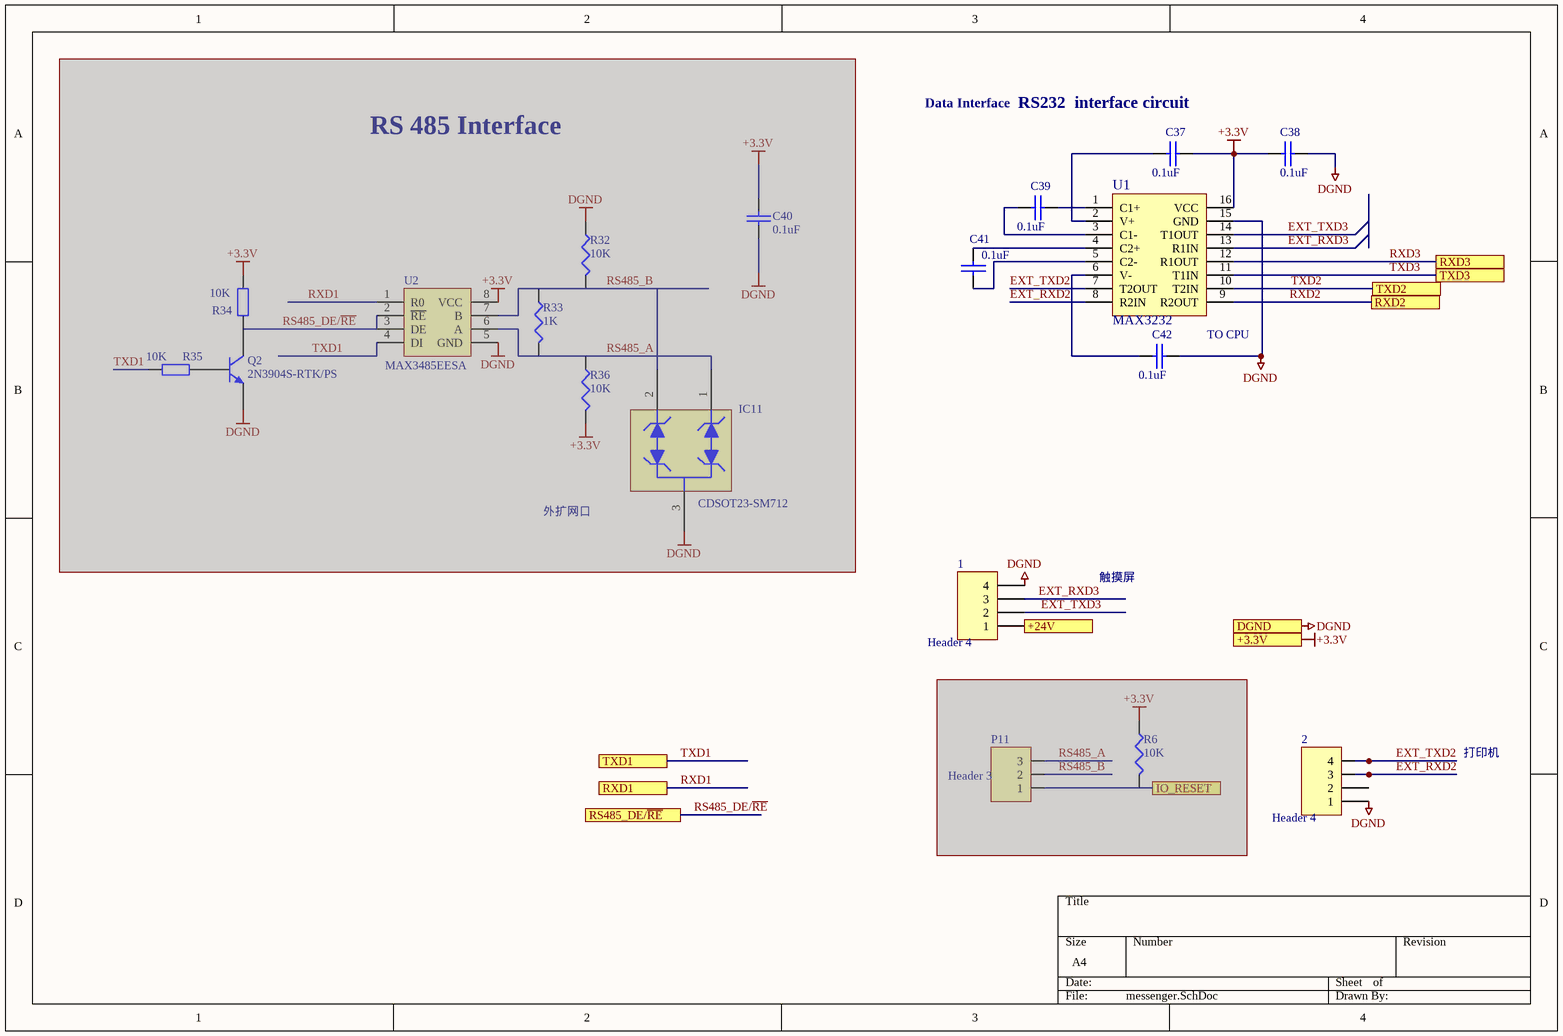
[diagram p5: messenger.SchDoc]

### Parts
1  Header 4  [XH2.54-4P]
2  Header 4  [XH2.54-4P]
C37  0.1uF  [0805C]
C38  0.1uF  [0805C]
C39  0.1uF  [0805C]
C40  0.1uF  [0805C]  (masked out: inside a compile mask, not in the netlist)
C41  0.1uF  [0805C]
C42  0.1uF  [0805C]
IC11  CDSOT23-SM712  [SOT23]  (masked out: inside a compile mask, not in the netlist)
P11  Header 3  [3PPP]  (masked out: inside a compile mask, not in the netlist)
Q2  2N3904S-RTK/PS  [SOT-23]  (masked out: inside a compile mask, not in the netlist)
R6  10K  [0805R]  (masked out: inside a compile mask, not in the netlist)
R32  10K  [0805R]  (masked out: inside a compile mask, not in the netlist)
R33  1K  [0805R]  (masked out: inside a compile mask, not in the netlist)
R34  10K  [0805R]  (masked out: inside a compile mask, not in the netlist)
R35  10K  [0805R]  (masked out: inside a compile mask, not in the netlist)
R36  10K  [0805R]  (masked out: inside a compile mask, not in the netlist)
U1  MAX3232  [SO16]
U2  MAX3485EESA  [SOP8]  (masked out: inside a compile mask, not in the netlist)

### Ports
+3.3V, +24V, DGND, IO_RESET, RS485_DE/~{RE}, RXD1, RXD2, RXD3, TXD1, TXD2, TXD3

### Nets
+3.3V: C37.2 C38.2 U1.16(VCC) ; port +3.3V
+24V: 1.1 ; port +24V
DGND: 1.4 2.1 C38.1 C42.2 U1.15(GND) ; port DGND
EXT_RXD2: 2.3 U1.8(R2IN)
EXT_RXD3: 1.3 U1.13(R1IN)
EXT_TXD2: 2.4 U1.7(T2OUT)
EXT_TXD3: 1.2 U1.14(T1OUT)
RXD2: U1.9(R2OUT) ; port RXD2
RXD3: U1.12(R1OUT) ; port RXD3
TXD2: U1.10(T2IN) ; port TXD2
TXD3: U1.11(T1IN) ; port TXD3
NetC37_1: C37.1 U1.2(V+)
NetC39_1: C39.1 U1.3(C1-)
NetC39_2: C39.2 U1.1(C1+)
NetC41_1: C41.1 U1.4(C2+)
NetC41_2: C41.2 U1.5(C2-)
NetC42_1: C42.1 U1.6(V-)

Not connected (* = marked no-connect by the designer): 2 2

### Notes on the sheet
- Data Interface
- (near C37) RS232  interface circuit
- RS 485 Interface
- TO CPU
- 外扩网口
- 触摸屏
- 打印机

### Library data of the parts
1 2 = Header 4: 品牌： Megastar(兆星)    型号： ZX-XH2.54-4PZZ    参考系列：XH 间距：2.54mm 插针结构：1x4P 排数：1 每排PIN数：4 公母：公型插针 安装方式：直插 额定电流：3A 触头材质：黄铜 触头镀层：锡 工作温度范围：-25℃~+85℃ 焊接温度(最大值)：260℃ 配套胶壳型号： ZX-XH2.54-4PJK 配套端子型号： ZX-XH2.54-DZ; LatestRevisionDate: 17-Jul-2002; LatestRevisionNote: Re-released for DXP Platform.; Publisher: Altium Limited
C37-C42 = CAP: 品牌： SAMSUNG(三星) 型号： CL21B104KBCNNNC ：容值：100nF 精度：±10% 额定电压：50V 材质(温度系数)：X7R 材质:X7R
IC11 = CDS0T23-SM712: 品牌： BOURNS     型号： CDSOT23-SM712   线路数：2 反向截止电压(Vrwm)：12V；7V 击穿电压(VBR)：13.3V；7.5V 钳位电压(Vc)@Ipp：26V；14V
P11 = Header 3: as P8 on sheet POWER; LatestRevisionDate: 17-Jul-2002; LatestRevisionNote: Re-released for DXP Platform.; Publisher: Altium Limited
Q2 = 2N3904: 品牌： KEC  型号： 2N3904S-RTK/PS  晶体管类型：NPN 集射极击穿电压(Vceo)：40V 集电极电流(Ic)：200mA 功率(Pd)：350mW 直流电流增益(hFE@Ic,Vce)：100@10mA,1V NPN,Vceo=40V,Ic=200mA; Published: 8-Jun-2000; LatestRevisionDate: 15-Jan-2003; LatestRevisionNote: PCB Footprint 'BCY-W3/D4.7' replaced; DatasheetVersion: 1997; PackageVersion: Sep-1998; PackageReference: TO-92A; Publisher: Altium Limited; PackageDescription: TO, Flat Index; 3 In-Line, Axial Leads; Body Dia. 4.5mm; Leads 0.51 x 0.48 mm (max); ComponentLink1Description: Manufacturer Link; ComponentLink1URL: http://www.fairchildsemi.com/; ComponentLink2Description: Datasheet; ComponentLink2URL: http://www.fairchildsemi.com/ds/2N%2F2N3904.pdf
R6 R32 R36 = RES1: as R31 on sheet In_put 
R33 = RES1: 品牌： UNI-ROYAL(厚声) 型号： 0805W8F1001T5E 电阻类型：厚膜电阻 阻值：1kΩ 精度：±1% 功率：125mW 温度系数：±100ppm/℃
R34 R35 = Res2: as R7 on sheet POWER; Published: 8-Jun-2000; LatestRevisionDate: 17-Jul-2002; LatestRevisionNote: Re-released for DXP Platform.; PackageReference: AXIAL-0.4; Publisher: Altium Limited; PackageDescription: Axial Device, Thru-Hole; 2 Leads; 0.4 in Pin Spacing; Value: 10K
U1 = MAX232: 品牌： UMW(友台半导体)   型号： MAX3232ESE   类型：收发器 驱动器/接收器：2/2 数据速率：250Kbps
U2 = MAX485: 品牌： ADI(亚德诺)/MAXIM(美信)   型号： MAX3485EESA+T  类型：收发器 驱动器/接收器：1/1 数据速率：12Mbps

## Sheet Light_Ctrol.SchDoc
size A4
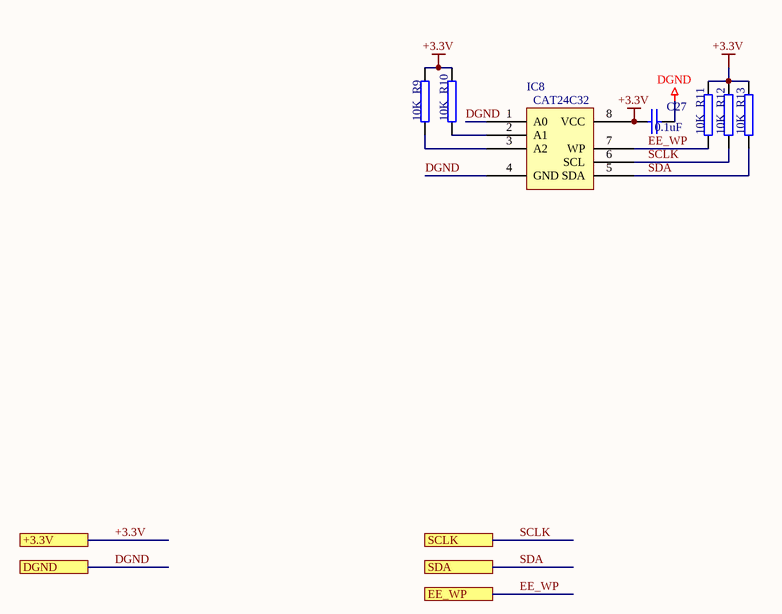
[diagram p6: Light_Ctrol.SchDoc]

### Parts
C27  0.1uF  [0805C]
IC8  CAT24C32  [SO8]
R9  10K  [0805R]
R10  10K  [0805R]
R11  10K  [0805R]
R12  10K  [0805R]
R13  10K  [0805R]

### Ports
+3.3V, DGND, EE_WP, SCLK, SDA

### Nets
+3.3V: C27.2 IC8.8(VCC) R9.1 R10.1 R11.1 R12.1 R13.1 ; port +3.3V
DGND: C27.1 IC8.1(A0) IC8.4(GND) ; port DGND
EE_WP: IC8.7(WP) R11.2 ; port EE_WP
SCLK: IC8.6(SCL) R12.2 ; port SCLK
SDA: IC8.5(SDA) R13.2 ; port SDA
NetIC8_2: IC8.2(A1) R10.2
NetIC8_3: IC8.3(A2) R9.2

### Library data of the parts
C27 = CAP: Capacitor
IC8 = CAT24C32: 品牌： onsemi(安森美)  型号： CAT24C32WI-GT3  接口类型：I2C 存储容量：32Kbit EEPROM 串行 32-Kb I2C CAT24C32 是一款 32-kb I2C 串行 EEPROM 器件，内部组织为 4096 个词，每个词 8 位。它具有 32 字节页写入缓存，支持标准 (100 kHz)、快速 (400 kHz) 和超快 (1 MHz) I2C 协议。外部地址引脚使其能够在同一个总线上放置最多八
R9-R13 = RES2: 品牌： UNI-ROYAL(厚声) 型号： 0805W8F1002T5E 电阻类型：厚膜电阻 阻值：10kΩ 精度：±1% 功率：125mW 温度系数：±100ppm/℃

## Sheet MCU_POWER.SchDoc
size A4
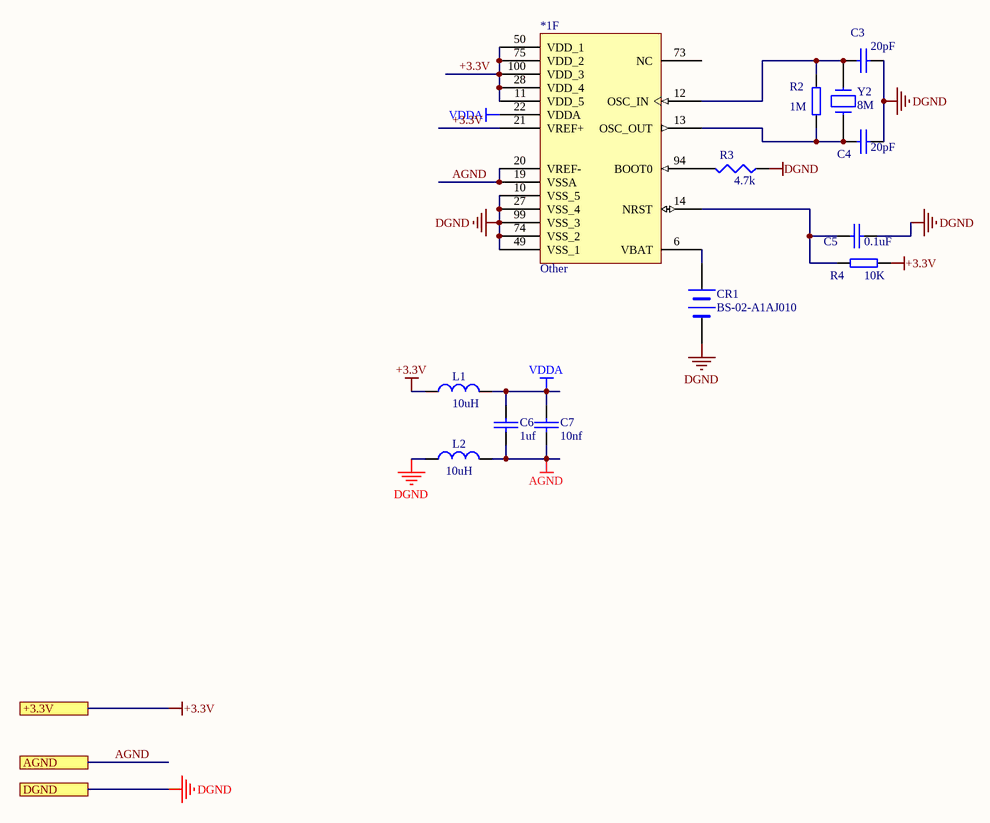
[diagram p7: MCU_POWER.SchDoc]

### Parts
*1  Other  [STM-LQFP100_N]  (part F of 6)
C3  20pF  [0805C]
C4  20pF  [0805C]
C5  0.1uF  [0805C]
C6  1uf  [0805C]
C7  10nf  [0805C]
CR1  BS-02-A1AJ010  [BATT]
L1  10uH  [L 0805]
L2  10uH  [L 0805]
R2  1M  [0805R]
R3  4.7k  [0805R]
R4  10K  [0805R]
Y2  8M  [XTAL3]

### Ports
+3.3V, AGND, DGND

### Nets
+3.3V: *1.11(VDD_5) *1.21(VREF+) *1.28(VDD_4) *1.50(VDD_1) *1.75(VDD_2) *1.100(VDD_3) L1.1 R4.2 ; port +3.3V
AGND: *1.19(VSSA) *1.20(VREF-) C6.1 C7.2 L2.2 ; port AGND
DGND: *1.10(VSS_5) *1.27(VSS_4) *1.49(VSS_1) *1.74(VSS_2) *1.99(VSS_3) C3.2 C4.2 C5.1 CR1.2(-) L2.1 R3.1 ; port DGND
VDDA: *1.22(VDDA) C6.2 C7.1 L1.2
Net*1_6: *1.6(VBAT) CR1.1(+)
Net*1_12: *1.12(OSC_IN) C3.1 R2.1 Y2.1
Net*1_13: *1.13(OSC_OUT) C4.1 R2.2 Y2.2
Net*1_14: *1.14(NRST) C5.2 R4.1
Net*1_94: *1.94(BOOT0) R3.2

Not connected (* = marked no-connect by the designer): *1 73(NC)

### Library data of the parts
*1 = stm32f103vct6
C3 C4 = CAP_3: 品牌： SAMSUNG(三星)  型号： CL21C200JBANNNC     容值：20pF 精度：±5% 额定电压：50V 材质(温度系数)：C0G 材质:C0G
C5 = CAP_3: 品牌： SAMSUNG(三星)    型号： CL10B104KB8NNNC  容值：100nF 精度：±10% 额定电压：50V 材质(温度系数)：X7R 材质:X7R
C6 = CAP_3: 品牌： SAMSUNG(三星)  型号： CL21B105KBFNNNE  容值：1uF 精度：±10% 额定电压：50V 材质(温度系数)：X7R 材质:X7R
C7 = CAP_3: 品牌： SAMSUNG(三星)  型号： CL21B103KBANNNC  容值：10nF 精度：±10% 额定电压：50V 材质(温度系数)：X7R 材质:X7R
CR1 = BATTERY: 品牌： MYOUNG(美阳)  型号： BS-02-A1AJ010  连接器类型：电池底座 适用电池规格：CR2032 工作温度范围：-25℃~+85℃ 插脚 卧式底座 环保吸塑托盘包装
L1 L2 = INDUCTOR: 品牌： FH(风华)  型号： CMI201209X100KT  ：电感值：10uH 精度：±10% 额定电流：15mA 直流电阻(DCR)：1.15Ω
R2 = RES4: 品牌： UNI-ROYAL(厚声)  型号： 0805W8F1004T5E  电阻类型：厚膜电阻 阻值：1MΩ 精度：±1% 功率：125mW 温度系数：±100ppm/℃
R3 = RES1: 品牌： UNI-ROYAL(厚声)  品牌： UNI-ROYAL(厚声)  电阻类型：厚膜电阻 阻值：100kΩ 精度：±1% 功率：125mW 温度系数：±100ppm/℃
R4 = RES4: 品牌： UNI-ROYAL(厚声) 型号： 0805W8F1002T5E 电阻类型：厚膜电阻 阻值：10kΩ 精度：±1% 功率：125mW 温度系数：±100ppm/℃
Y2 = XTAL-1: 品牌： YXC(扬兴晶振)  型号： X49SD8MSD2SC   频率：8MHz 频率公差：±20ppm 负载电容：20pF 频率： 8MHz 负载： 20pF 频率公差： ±20ppm 工作温度： -20~70℃

## Sheet SSR_Ctrol.SchDoc
size A4
Used 3 times, as channels c1, c2, c3. Parts and nets are listed once, with the designators drawn on the sheet.
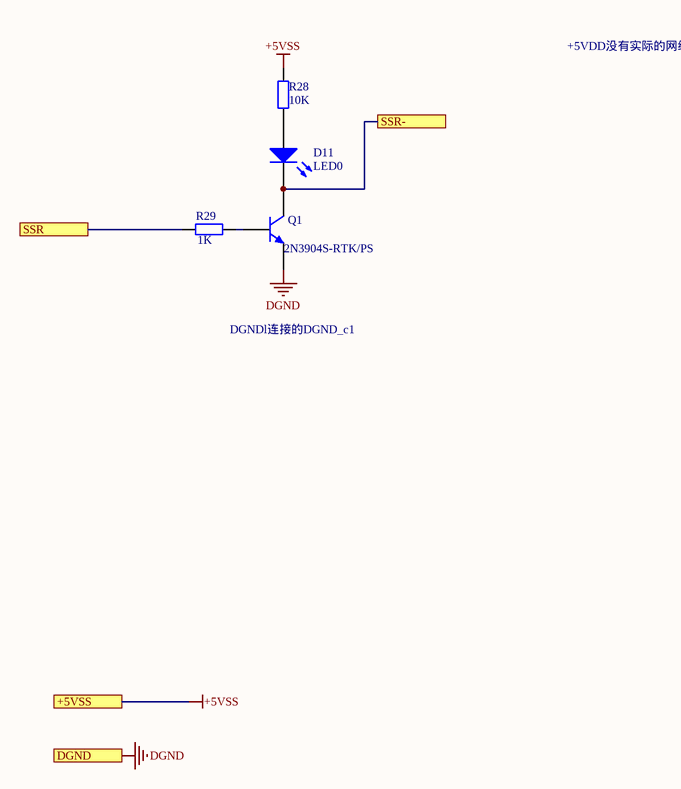
[diagram p8: SSR_Ctrol.SchDoc]

### Parts
D11  LED0  [0805LED]
Q1  2N3904S-RTK/PS  [SOT-23]
R28  10K  [0805R]
R29  1K  [0805R]

### Ports
+5VSS, DGND, SSR, SSR-

### Nets
+5VSS: R28.2 ; port +5VSS
DGND: Q1.2(E) ; port DGND
SSR: R29.1 ; port SSR
SSR-: D11.2(K) Q1.3(C) ; port SSR-
NetD11_1: D11.1(A) R28.1
NetQ1_1: Q1.1(B) R29.2

### Channels
c1: designators end in _c1; ports +5VSS=+5VSS DGND=DGND SSR-=SSR-1 SSR=SSR1
c2: designators end in _c2; ports +5VSS=+5VSS DGND=DGND SSR-=SSR-2 SSR=SSR2
c3: designators end in _c3; ports +5VSS=+5VSS DGND=DGND SSR-=SSR-3 SSR=SSR3

### Notes on the sheet
- +5VDD没有实际的网络标号
- DGNDl连接的DGND_c1

### Library data of the parts
D11 = LED0: as D6 on sheet POWER; Published: 8-Jun-2000; LatestRevisionDate: 08-Jul-2005; LatestRevisionNote: Mech Layer 1 removed.; PackageReference: LED-0; Publisher: Altium Limited; PackageDescription: LED; 2 Leads
Q1 = 2N3904: as Q2 on sheet messenger; Published: 8-Jun-2000; LatestRevisionDate: 15-Jan-2003; LatestRevisionNote: PCB Footprint 'BCY-W3/D4.7' replaced; DatasheetVersion: 1997; PackageVersion: Sep-1998; PackageReference: TO-92A; Publisher: Altium Limited; PackageDescription: TO, Flat Index; 3 In-Line, Axial Leads; Body Dia. 4.5mm; Leads 0.51 x 0.48 mm (max); ComponentLink1Description: Manufacturer Link; ComponentLink1URL: http://www.fairchildsemi.com/; ComponentLink2Description: Datasheet; ComponentLink2URL: http://www.fairchildsemi.com/ds/2N%2F2N3904.pdf
R28 = Res2: as R7 on sheet POWER; Published: 8-Jun-2000; LatestRevisionDate: 17-Jul-2002; LatestRevisionNote: Re-released for DXP Platform.; PackageReference: AXIAL-0.4; Publisher: Altium Limited; PackageDescription: Axial Device, Thru-Hole; 2 Leads; 0.4 in Pin Spacing; Value: 10K
R29 = Res2: 品牌： UNI-ROYAL(厚声) 型号： 0805W8F1001T5E 电阻类型：厚膜电阻 阻值：1kΩ 精度：±1% 功率：125mW 温度系数：±100ppm/℃; Published: 8-Jun-2000; LatestRevisionDate: 17-Jul-2002; LatestRevisionNote: Re-released for DXP Platform.; PackageReference: AXIAL-0.4; Publisher: Altium Limited; PackageDescription: Axial Device, Thru-Hole; 2 Leads; 0.4 in Pin Spacing; Value: 1K

## Sheet 说明.SchDoc
size A4
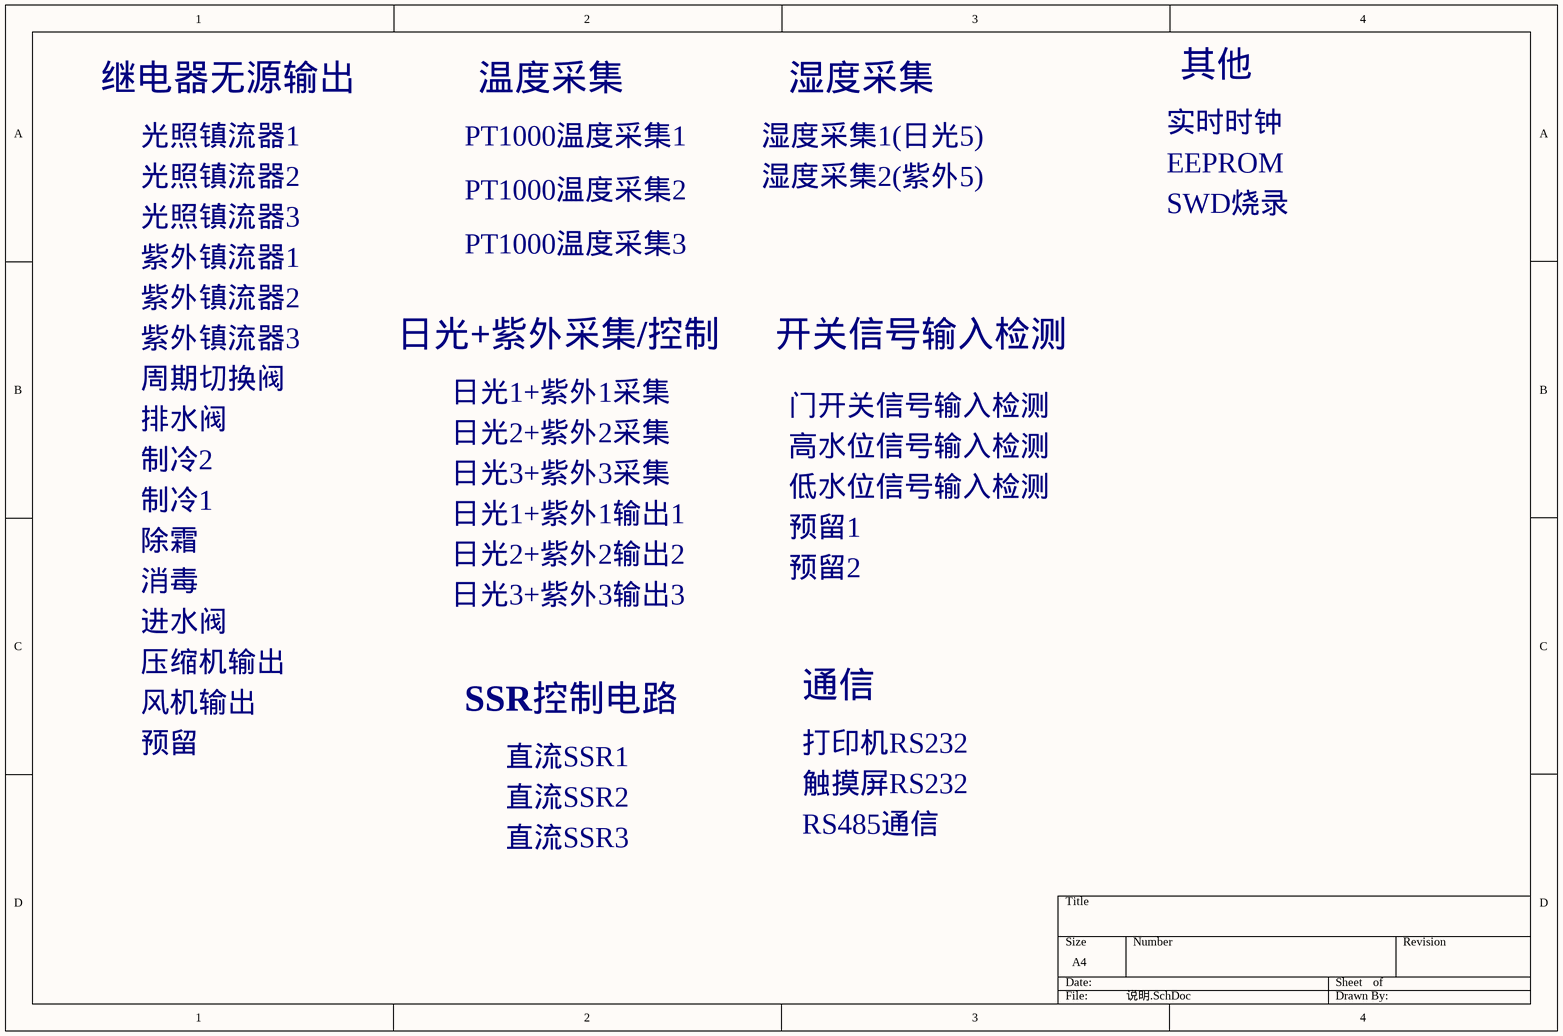
[diagram p9: 说明.SchDoc]

### Notes on the sheet
- 继电器无源输出
- 温度采集
- 湿度采集
- 其他
- 光照镇流器1
- PT1000温度采集1
- 湿度采集1(日光5)
- 实时时钟
- EEPROM
- 光照镇流器2
- 光照镇流器3
- PT1000温度采集2
- 湿度采集2(紫外5)
- SWD烧录
- 紫外镇流器1
- 紫外镇流器2
- PT1000温度采集3
- 紫外镇流器3
- 日光+紫外采集/控制
- 开关信号输入检测
- 排水阀
- 周期切换阀
- 日光1+紫外1采集
- 日光2+紫外2采集
- 门开关信号输入检测
- 制冷1
- 制冷2
- 日光3+紫外3采集
- 高水位信号输入检测
- 低水位信号输入检测
- 除霜
- 日光1+紫外1输出1
- 日光2+紫外2输出2
- 预留1
- 预留2
- 消毒
- 进水阀
- 日光3+紫外3输出3
- 风机输出
- 压缩机输出
- SSR控制电路
- 通信
- 预留
- 直流SSR1
- 打印机RS232
- 直流SSR2
- 直流SSR3
- 触摸屏RS232
- RS485通信

## Sheet Hum_ADC.SchDoc
size A4
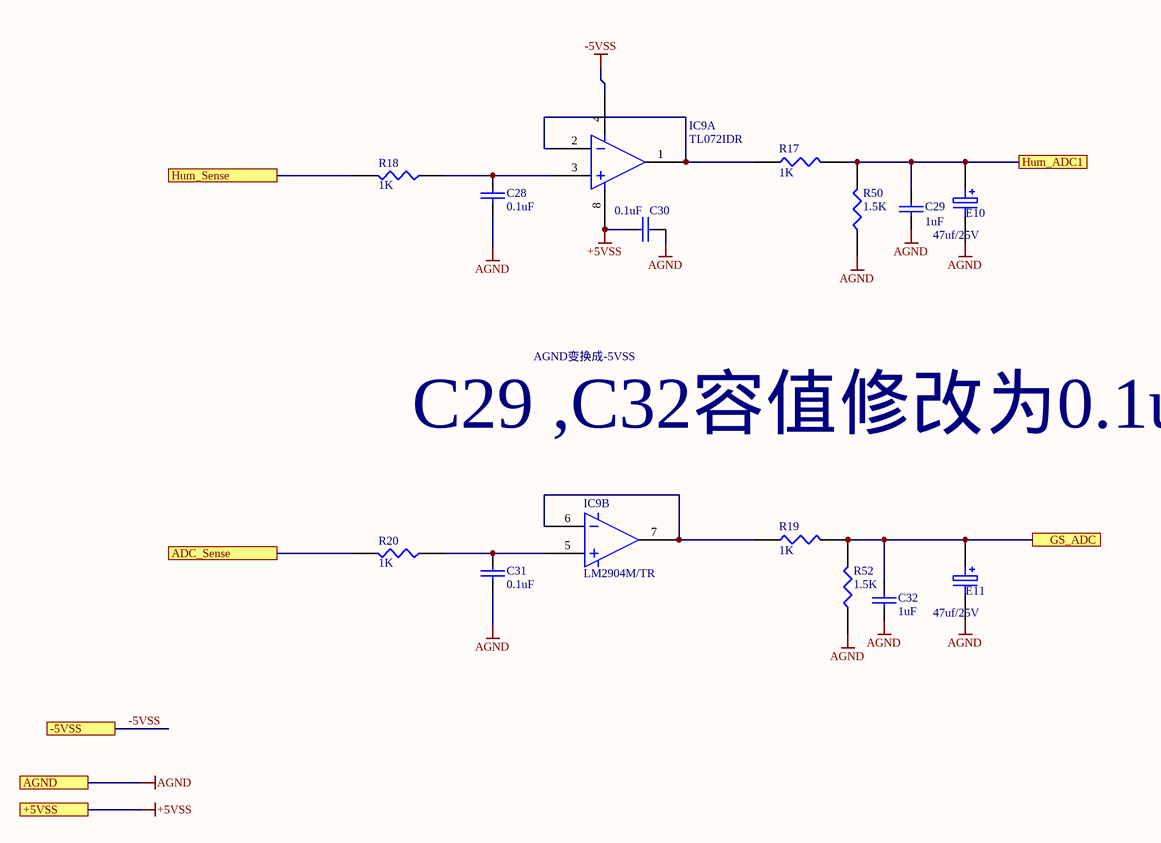
[diagram p10: Hum_ADC.SchDoc]

### Parts
C28  0.1uF  [0805C]
C29  1uF  [0805C]
C30  0.1uF  [0805C]
C31  0.1uF  [0805C]
C32  1uF  [0805C]
E10  47uf/25V  [CAP-TH_BD5.0-P2.00-D0.8-FD]
E11  47uf/25V  [CAP-TH_BD5.0-P2.00-D0.8-FD]
IC9  TL072IDR  [LM2904M/TR]  (parts A,B of 2)
R17  1K  [0805R]
R18  1K  [0805R]
R19  1K  [0805R]
R20  1K  [0805R]
R50  1.5K  [0805R]
R52  1.5K  [0805R]

### Ports
+5VSS, -5VSS, ADC_Sense, AGND, GS_ADC, Hum_ADC1, Hum_Sense

### Nets
+5VSS: C30.2 IC9.8 ; port +5VSS
-5VSS: IC9.4 ; port -5VSS
AGND: C28.2 C29.2 C30.1 C31.2 C32.2 E10.2 E11.2 R50.1 R52.1 ; port AGND
ADC_Sense: R20.2 ; port ADC_Sense
GS_ADC: C32.1 E11.1 R19.2 R52.2 ; port GS_ADC
Hum_ADC1: C29.1 E10.1 R17.2 R50.2 ; port Hum_ADC1
Hum_Sense: R18.2 ; port Hum_Sense
NetC28_1: C28.1 IC9.3 R18.1
NetC31_1: C31.1 IC9.5 R20.1
NetIC9_1: IC9.1 IC9.2 R17.1
NetIC9_6: IC9.6 IC9.7 R19.1

### Notes on the sheet
- AGND变换成-5VSS
- C29 ,C32容值修改为0.1uf

### Library data of the parts
C28-C32 = CAP: as C37 on sheet messenger
E10 E11 = ELECTRO1: as E6 on sheet POWER
IC9 = TL072: 品牌： HGSEMI(华冠)   型号： LM2904M/TR
R17-R20 R50 R52 = RES1: as R33 on sheet messenger

## Sheet FLASH.SchDoc
size A4
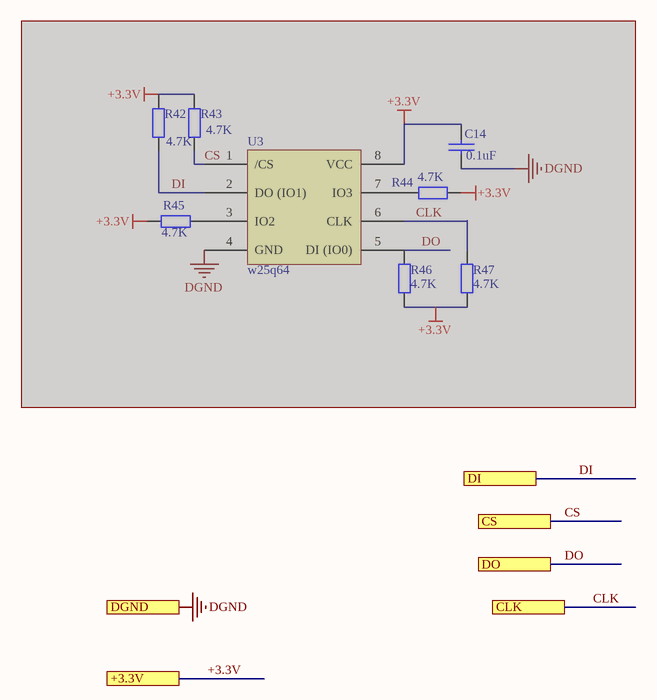
[diagram p11: FLASH.SchDoc]

### Parts
C14  0.1uF  [0805C]  (masked out: inside a compile mask, not in the netlist)
R42  4.7K  [0805R]  (masked out: inside a compile mask, not in the netlist)
R43  4.7K  [0805R]  (masked out: inside a compile mask, not in the netlist)
R44  4.7K  [0805R]  (masked out: inside a compile mask, not in the netlist)
R45  4.7K  [0805R]  (masked out: inside a compile mask, not in the netlist)
R46  4.7K  [0805R]  (masked out: inside a compile mask, not in the netlist)
R47  4.7K  [0805R]  (masked out: inside a compile mask, not in the netlist)
U3  w25q64  [W25Q64]  (masked out: inside a compile mask, not in the netlist)

### Ports
+3.3V, CLK, CS, DGND, DI, DO

### Library data of the parts
C14 = CAP_3: 品牌： SAMSUNG(三星) 型号： CL21B104KBCNNNC ：容值：100nF 精度：±10% 额定电压：50V 材质(温度系数)：X7R 材质:X7R
R42-R47 = RES2: 品牌： UNI-ROYAL(厚声) 型号： 0805W8F3301T5E  电阻类型：厚膜电阻 阻值：3.3kΩ 精度：±1% 功率：125mW 温度系数：±100ppm/℃; Manufacturer: Generic Components; Class: Passive; SubClass: Resistor; Published: 08/06/2000; Publisher: Altium Hobart Technology Centre
U3 = w25q64: 品牌： WINBOND(华邦)   型号： W25Q64JVSSIM

## Sheet Ctrol1,Ctrol2.SchDoc
size A4
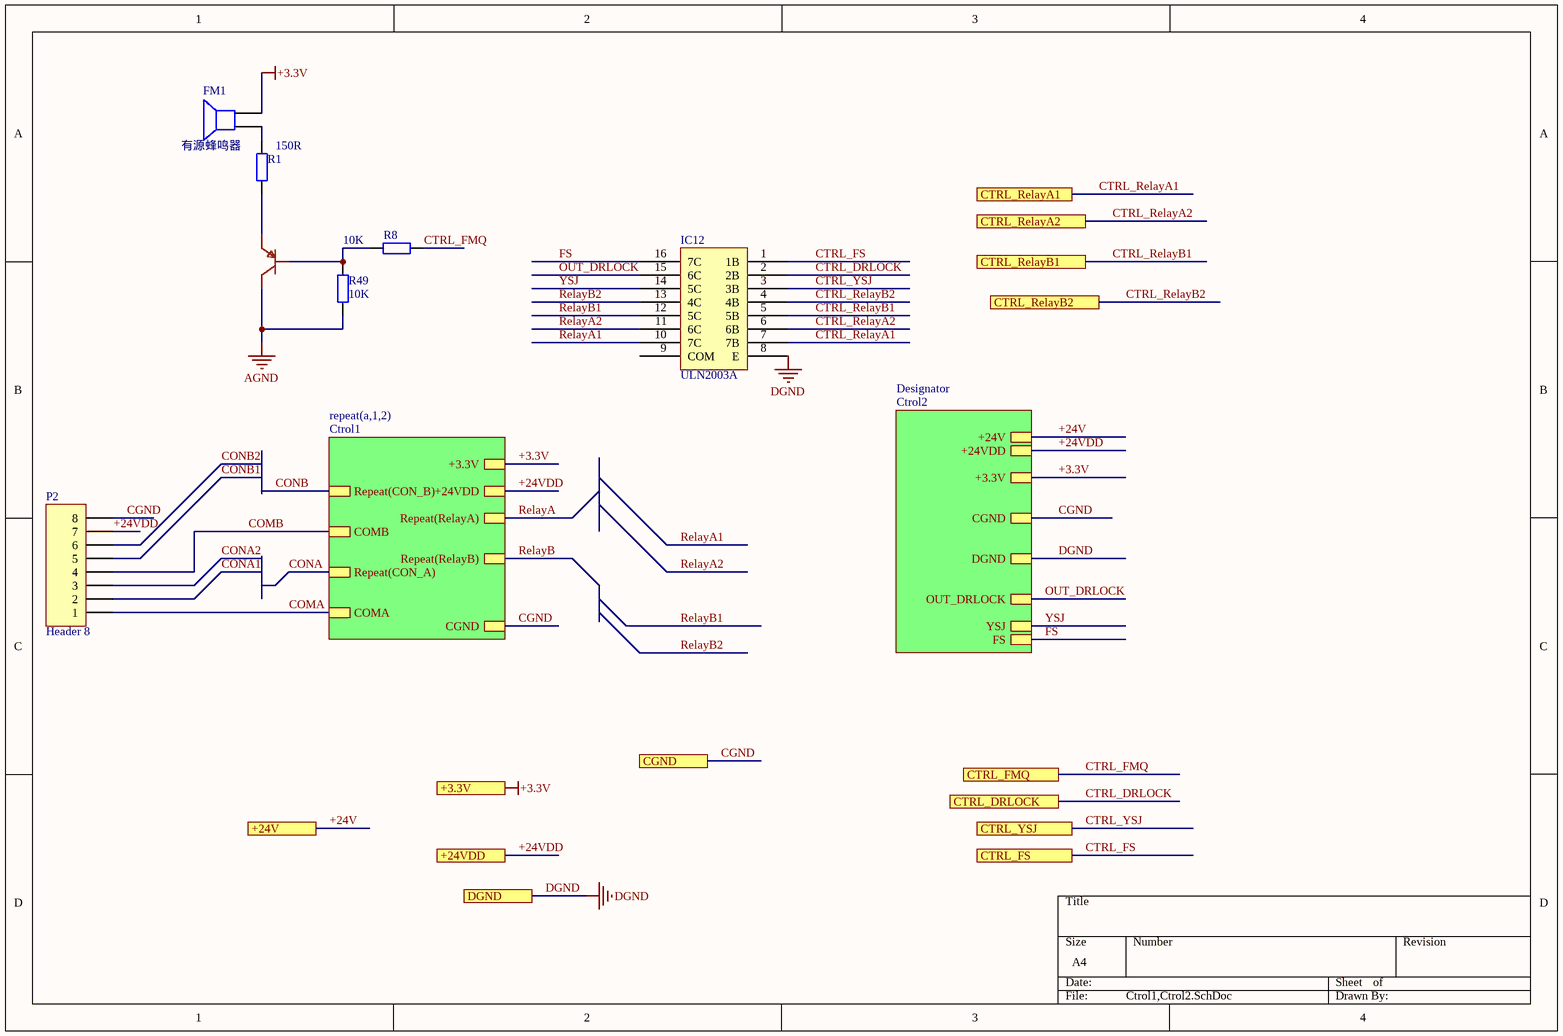
[diagram p12: Ctrol1,Ctrol2.SchDoc]

### Parts
FM1  有源蜂鸣器  [SPK]
IC12  ULN2003A  [SO16]
P2  Header 8  [CONN-TH-KF7.62-8p]
Q3  SS8550  [SOT23]  (value not drawn)
R1  150R  [0805R]
R8  10K  [0805R]
R49  10K  [0805R]

### Sub-sheets
Designator = Ctrol2: +24V, +3.3V, CGND, DGND, OUT_DRLOCK, YSJ, FS, +24VDD
repeat(a,1,2) = Ctrol1: +3.3V, +24VDD, Repeat(RelayA), Repeat(RelayB), CGND, COMA, Repeat(CON_A), COMB, Repeat(CON_B)

### Ports
+3.3V, +24V, +24VDD, CGND, CTRL_DRLOCK, CTRL_FMQ, CTRL_FS, CTRL_RelayA1, CTRL_RelayA2, CTRL_RelayB1, CTRL_RelayB2, CTRL_YSJ, DGND

### Nets
+3.3V: FM1.2 ; port +3.3V, sheet repeat(a,1,2)/+3.3V, sheet Designator/+3.3V
+24V: port +24V, sheet Designator/+24V
+24VDD: P2.7 ; port +24VDD, sheet repeat(a,1,2)/+24VDD, sheet Designator/+24VDD
AGND: Q3.3(C) R49.2
CGND: P2.8 ; port CGND, sheet repeat(a,1,2)/CGND, sheet Designator/CGND
DGND: IC12.8(E) ; port DGND, sheet Designator/DGND
COMA: P2.1 ; sheet repeat(a,1,2)/COMA
COMB: P2.4 ; sheet repeat(a,1,2)/COMB
CONA: sheet repeat(a,1,2)/Repeat(CON_A)
CONA1: P2.2
CONA2: P2.3
CONB: sheet repeat(a,1,2)/Repeat(CON_B)
CONB1: P2.5
CONB2: P2.6
CTRL_DRLOCK: IC12.2(2B) ; port CTRL_DRLOCK
CTRL_FMQ: R8.2 ; port CTRL_FMQ
CTRL_FS: IC12.1(1B) ; port CTRL_FS
CTRL_RelayA1: IC12.7(7B) ; port CTRL_RelayA1
CTRL_RelayA2: IC12.6(6B) ; port CTRL_RelayA2
CTRL_RelayB1: IC12.5(5B) ; port CTRL_RelayB1
CTRL_RelayB2: IC12.4(4B) ; port CTRL_RelayB2
CTRL_YSJ: IC12.3(3B) ; port CTRL_YSJ
FS: IC12.16(7C) ; sheet Designator/FS
OUT_DRLOCK: IC12.15(6C) ; sheet Designator/OUT_DRLOCK
RelayA: sheet repeat(a,1,2)/Repeat(RelayA)
RelayA1: IC12.10(7C)
RelayA2: IC12.11(6C)
RelayB: sheet repeat(a,1,2)/Repeat(RelayB)
RelayB1: IC12.12(5C)
RelayB2: IC12.13(4C)
YSJ: IC12.14(5C) ; sheet Designator/YSJ
NetFM1_1: FM1.1 R1.2
NetQ3_1: Q3.1(B) R8.1 R49.1
NetQ3_2: Q3.2(E) R1.1

Not connected (* = marked no-connect by the designer): IC12 9(COM)

### Library data of the parts
FM1 = Speaker: 直径φ12*9.5mm 3V 3.3V 电磁式有源一体蜂鸣器 电磁蜂鸣器 有源蜂鸣器 直径φ12*9.5mm 华能蜂鸣器 / 品牌名称 / 华能 / 商品型号 / TMB12A03 / 商品编号 / C96222 / 商品封装 / 插件,D=12mm; value: 3.3V 12*9.5; Published: *; Manufacturer: *
IC12 = ULN2003
P2 = Header 8: DG141V-2.54-8; LatestRevisionDate: 17-Jul-2002; LatestRevisionNote: Re-released for DXP Platform.; Publisher: Altium Limited
Q3 = SS8550_C7420371: 牌: CJ(江苏长电/长晶) / 封装: SOT-23 / 描述: hfe=200~350 / 晶体管类型: PNP / 集电极电流(Ic): 1.5A / 集射极击穿电压(Vceo): 25V / 耗散功率(Pd): 300mW / 类目: 三极管(BJT) / 编号: C8542; Manufacturer: 宏迦橙; Add into BOM: yes; DC Current Gain (hFE@Ic,Vce): 120@100mA,1.0V; Transition Frequency (fT): 100MHz; Collector Cut-Off Current (Icbo): 100nA; Collector-Emitter Saturation Voltage (VCE(sat)@Ic,Ib): 500mV@800mA,80mA; Symbol: SS8550_C7420371; Device: SS8550_C7420371; LCSC Part Name: 耐压:25V 电流:1.5A PNP H档 200-350; Supplier Part: C7420371; Manufacturer Part: SS8550; Supplier Footprint: SOT-23; JLCPCB Part Class: Extended Part; Datasheet: https://atta.szlcsc.com/upload/public/pdf/source/20231222/5BDA6DBF3A79C59009F81F0EEE6F8969.pdf; Supplier: LCSC; Convert to PCB: yes; Transistor Type: PNP; Collector Current (Ic): 1.5A; Collector-Emitter Breakdown Voltage (Vceo): 25V; Power Dissipation (Pd): 300mW; Operating Temperature: -55℃~+150℃
R1 = Res2: Resistor; Value: 10K; Published: 8-Jun-2000; LatestRevisionDate: 17-Jul-2002; LatestRevisionNote: Re-released for DXP Platform.; PackageReference: AXIAL-0.4; Publisher: Altium Limited; PackageDescription: Axial Device, Thru-Hole; 2 Leads; 0.4 in Pin Spacing
R8 R49 = Res2: Resistor; Published: 8-Jun-2000; LatestRevisionDate: 17-Jul-2002; LatestRevisionNote: Re-released for DXP Platform.; PackageReference: AXIAL-0.4; Publisher: Altium Limited; PackageDescription: Axial Device, Thru-Hole; 2 Leads; 0.4 in Pin Spacing; Value: 10K

## Sheet Ctrol1.SchDoc
size A4
Used 2 times, as channels Designator/a1, Designator/a2. Parts and nets are listed once, with the designators drawn on the sheet.
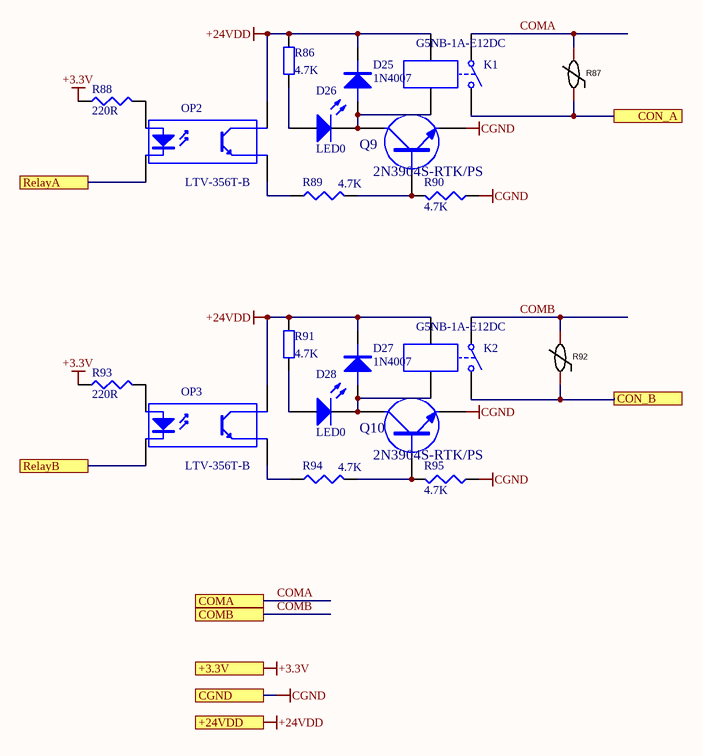
[diagram p13: Ctrol1.SchDoc]

### Parts
D25  1N4007  [DO-213AB]
D26  LED0  [0805LED]
D27  1N4007  [DO-213AB]
D28  LED0  [0805LED]
K1  G5NB-1A-E12DC  [G5NB-1A-E]
K2  G5NB-1A-E12DC  [G5NB-1A-E]
OP2  LTV-356T-B  [TLV-356]
OP3  LTV-356T-B  [TLV-356]
Q9  2N3904S-RTK/PS  [SOT-23]
Q10  2N3904S-RTK/PS  [SOT-23]
R86  4.7K  [0805R]
R87  RM10D471KD14E100  [YAMINGDIANZU]  (value not drawn)
R88  220R  [0805R]
R89  4.7K  [0805R]
R90  4.7K  [0805R]
R91  4.7K  [0805R]
R92  RM10D471KD14E100  [YAMINGDIANZU]  (value not drawn)
R93  220R  [0805R]
R94  4.7K  [0805R]
R95  4.7K  [0805R]

### Ports
+3.3V, +24VDD, CGND, COMA, COMB, CON_A, CON_B, RelayA, RelayB

### Nets
+3.3V: R88.1 R93.1 ; port +3.3V
+24VDD: D25.2(K) D27.2(K) K1.1 K2.1 OP2.4(C) OP3.4(C) R86.1 R91.1 ; port +24VDD
CGND: Q9.2(E) Q10.2(E) R90.1 R95.1 ; port CGND
COMA: K1.2 R87.2 ; port COMA
COMB: K2.2 R92.2 ; port COMB
CON_A: K1.3 R87.1 ; port CON_A
CON_B: K2.3 R92.1 ; port CON_B
RelayA: OP2.2(K) ; port RelayA
RelayB: OP3.2(K) ; port RelayB
NetD25_1: D25.1(A) D26.2(K) K1.4 Q9.3(C)
NetD26_1: D26.1(A) R86.2
NetD27_1: D27.1(A) D28.2(K) K2.4 Q10.3(C)
NetD28_1: D28.1(A) R91.2
NetOP2_1: OP2.1(A) R88.2
NetOP2_3: OP2.3(E) R89.1
NetOP3_1: OP3.1(A) R93.2
NetOP3_3: OP3.3(E) R94.1
NetQ9_1: Q9.1(B) R89.2 R90.2
NetQ10_1: Q10.1(B) R94.2 R95.2

### Channels
Designator/a1: designators end in _a1; ports +3.3V=+3.3V +24VDD=+24VDD CGND=CGND COMA=COMA COMB=COMB CON_A=CONA1 CON_B=CONB1 RelayA=RelayA1 RelayB=RelayB1
Designator/a2: designators end in _a2; ports +3.3V=+3.3V +24VDD=+24VDD CGND=CGND COMA=COMA COMB=COMB CON_A=CONA2 CON_B=CONB2 RelayA=RelayA2 RelayB=RelayB2

### Library data of the parts
D25 D27 = DIODE: 品牌： TWGMC(台湾迪嘉) 型号： 1N4007 二极管配置：独立式 直流反向耐压(Vr)：1kV 平均整流电流(Io)：1A 正向压降(Vf)：1.1V@1A 二极管配置：独立式 直流反向耐压(Vr)：1kV 平均整流电流(Io)：1A 正向压降(Vf)：1.1V@1A
D26 D28 = LED0: as D6 on sheet POWER; Published: 8-Jun-2000; LatestRevisionDate: 08-Jul-2005; LatestRevisionNote: Mech Layer 1 removed.; PackageReference: LED-0; Publisher: Altium Limited; PackageDescription: LED; 2 Leads
K1 K2 = Relay-G5NB-1A-E: 品牌： OMRON(欧姆龙) 型号： G5NB-1A-E DC12 封装： 插件,7x20.4mm; Published: 24-Mar-1999; LatestRevisionDate: 17-Jul-2002; LatestRevisionNote: Re-released for DXP Platform.; PackageReference: MODULE4; Publisher: Altium Limited
OP2 OP3 = OPTOISO1: as OP1 on sheet In_put 
Q9 Q10 = 8050: 品牌： KEC   型号： 2N3904S-RTK/PS 晶体管类型：NPN 集射极击穿电压(Vceo)：40V 集电极电流(Ic)：200mA 功率(Pd)：350mW 直流电流增益(hFE@Ic,Vce)：100@10mA,1V NPN,Vceo=40V,Ic=200mA
R86 R91 = Res2: 品牌： UNI-ROYAL(厚声) 型号： 0805W8F4701T5E 电阻类型：厚膜电阻 阻值：4.7kΩ 精度：±1% 功率：125mW 温度系数：±100ppm/℃; Value: 10K; Published: 8-Jun-2000; LatestRevisionDate: 17-Jul-2002; LatestRevisionNote: Re-released for DXP Platform.; PackageReference: AXIAL-0.4; Publisher: Altium Limited; PackageDescription: Axial Device, Thru-Hole; 2 Leads; 0.4 in Pin Spacing
R87 R92 = RM10D471KD14E100: Manufacturer: Dersonic(德尔创); Add into BOM: yes; Varistor Voltage: 470V; Clamping Voltage: 775V; Allowable Voltage (DC): 385V; Allowable Voltage (AC): 300V; Peak Current: 2.5kA; Maximum Energy: 67J; Typical Capatitance: 210pF@1kHz; Rated Wattage: 400mW; Symbol: RM10D471KD14E100; Device: RM10D471KD14E100; LCSC Part Name: 钳位电压775V 67焦耳 插件压敏电阻; Supplier Part: C2974809; Manufacturer Part: RM10D471KD14E100; Supplier Footprint: 插件,P=7.5mm; JLCPCB Part Class: Extended Part; Datasheet: https://atta.szlcsc.com/upload/public/pdf/source/20220216/7E2B8E32815A179BCD41409596CBB68C.pdf; Supplier: LCSC; Convert to PCB: yes
R88 R93 = RES1: 品牌： UNI-ROYAL(厚声) 型号： 0805W8J0221T5E 电阻类型：厚膜电阻 阻值：220Ω 精度：±5% 功率：125mW 温度系数：±100ppm/℃
R89 R90 R94 R95 = RES1: 品牌： UNI-ROYAL(厚声) 型号： 0805W8F4701T5E 电阻类型：厚膜电阻 阻值：4.7kΩ 精度：±1% 功率：125mW 温度系数：±100ppm/℃